# Altium project QUTMS-CC-V00.PrjPcb (part 1 of 2)
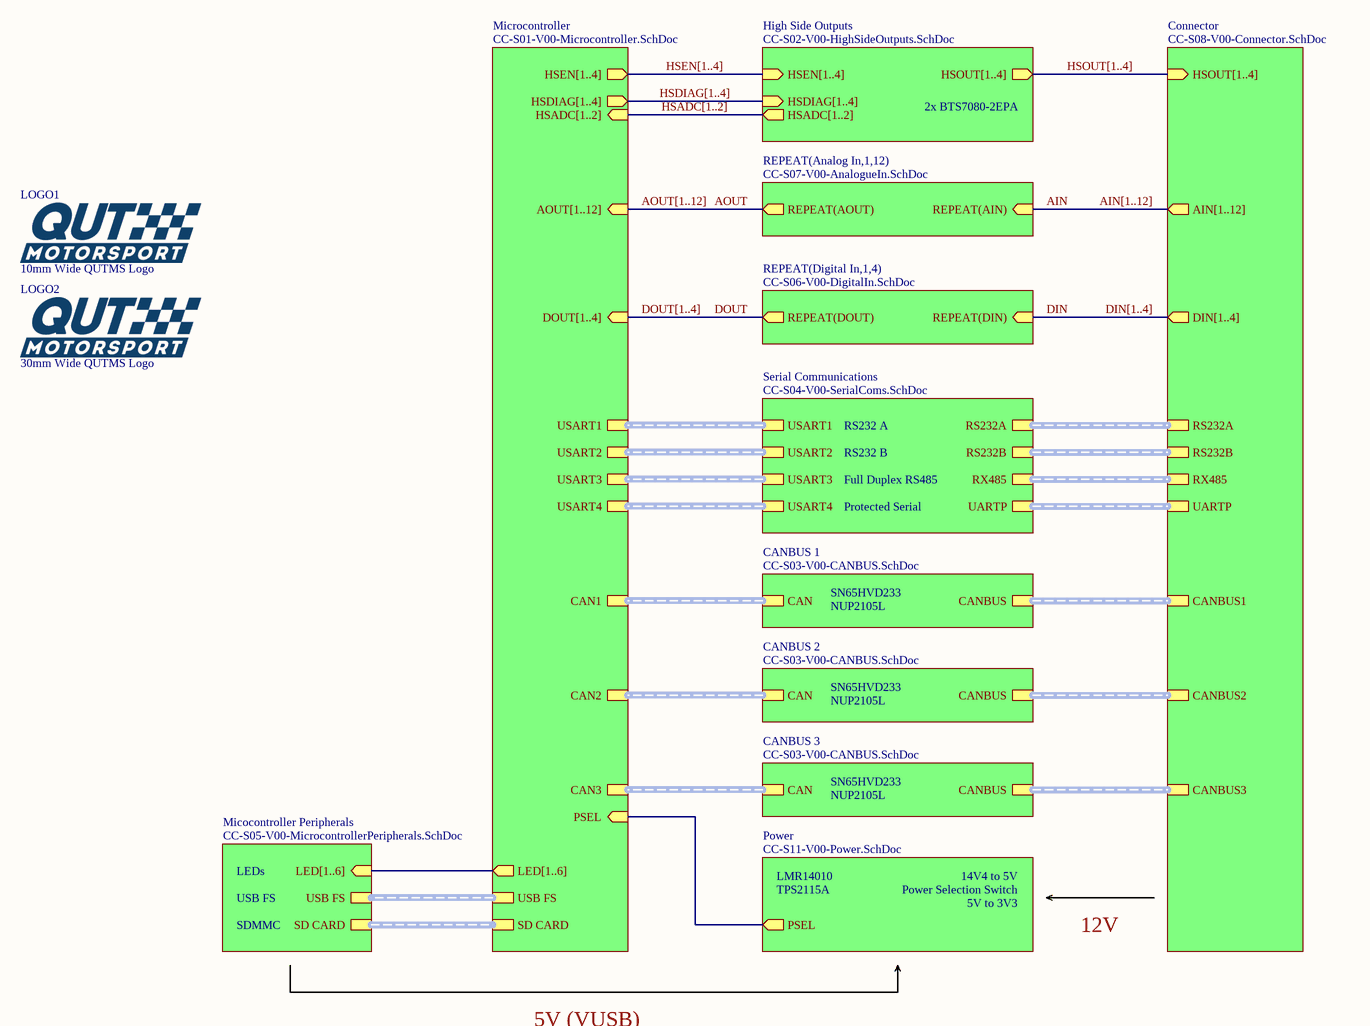
[diagram p0: CC-S00-V00-ChassisController.SchDoc]
13 sheets, 271 parts. Net scope: hierarchical (ports join the sheet entries above them; power ports are global).
Board file: CC-B00-V00.PcbDoc
Sheets:
  CC-S00-V00-ChassisController.SchDoc
    CANBUS 1 = CC-S03-V00-CANBUS.SchDoc
    CANBUS 2 = CC-S03-V00-CANBUS.SchDoc
    CANBUS 3 = CC-S03-V00-CANBUS.SchDoc
    Connector = CC-S08-V00-Connector.SchDoc
    Serial Communications = CC-S04-V00-SerialComs.SchDoc
    Digital In1 = CC-S06-V00-DigitalIn.SchDoc
    Digital In2 = CC-S06-V00-DigitalIn.SchDoc
    Digital In3 = CC-S06-V00-DigitalIn.SchDoc
    Digital In4 = CC-S06-V00-DigitalIn.SchDoc
    Analog In1 = CC-S07-V00-AnalogueIn.SchDoc
    Analog In2 = CC-S07-V00-AnalogueIn.SchDoc
    Analog In3 = CC-S07-V00-AnalogueIn.SchDoc
    Analog In4 = CC-S07-V00-AnalogueIn.SchDoc
    Analog In5 = CC-S07-V00-AnalogueIn.SchDoc
    Analog In6 = CC-S07-V00-AnalogueIn.SchDoc
    Analog In7 = CC-S07-V00-AnalogueIn.SchDoc
    Analog In8 = CC-S07-V00-AnalogueIn.SchDoc
    Analog In9 = CC-S07-V00-AnalogueIn.SchDoc
    Analog In10 = CC-S07-V00-AnalogueIn.SchDoc
    Analog In11 = CC-S07-V00-AnalogueIn.SchDoc
    Analog In12 = CC-S07-V00-AnalogueIn.SchDoc
    High Side Outputs = CC-S02-V00-HighSideOutputs.SchDoc
    Microcontroller = CC-S01-V00-Microcontroller.SchDoc
    Micocontroller Peripherals = CC-S05-V00-MicrocontrollerPeripherals.SchDoc
    Power = CC-S11-V00-Power.SchDoc
      5V Supply = CC-S10-V00-PSU-5V.SchDoc
      3V3 Supply = CC-S09-V00-PSU-3V3.SchDoc
      Power Selection = CC-S12-V00-PowerSwitch.SchDoc

## Sheet CC-S00-V00-ChassisController.SchDoc: Chassis Controller (Interim) 2020
size A3; DrawnBy: Jonn Dillon; DocumentNumber: 1; SheetNumber: 1; SheetTotal: 13; Project: Chassis Controller (Interim) 2020

### Parts
LOGO1  10mm Wide QUTMS Logo  [QUTMS LOGO 10MM]
LOGO2  30mm Wide QUTMS Logo  [QUTMS LOGO 30MM]

### Sub-sheets
CANBUS 1 = CC-S03-V00-CANBUS.SchDoc: CANBUS (harness CANBUS), CAN (harness CAN)
CANBUS 2 = CC-S03-V00-CANBUS.SchDoc: CANBUS (harness CANBUS), CAN (harness CAN)
CANBUS 3 = CC-S03-V00-CANBUS.SchDoc: CAN (harness CAN), CANBUS (harness CANBUS)
Connector = CC-S08-V00-Connector.SchDoc: HSOUT[1..4] (in), CANBUS1 (harness CANBUS), CANBUS2 (harness CANBUS), CANBUS3 (harness CANBUS), AIN[1..12] (out), DIN[1..4] (out), RS232A (harness RS232), RS232B (harness RS232), RX485 (harness RS485), UARTP (harness UART)
High Side Outputs = CC-S02-V00-HighSideOutputs.SchDoc: HSDIAG[1..4] (in), HSOUT[1..4] (out), HSADC[1..2] (out), HSEN[1..4] (in)
Micocontroller Peripherals = CC-S05-V00-MicrocontrollerPeripherals.SchDoc: USB FS (harness USB FS), SD CARD (harness SD CARD), LED[1..6] (in)
Microcontroller = CC-S01-V00-Microcontroller.SchDoc: USB FS (harness USB FS), SD CARD (harness SD CARD), PSEL (in), USART1 (harness UART), USART2 (harness UART), USART3 (harness UART), USART4 (harness UART), HSEN[1..4] (out), HSDIAG[1..4] (out), HSADC[1..2] (in), CAN3 (harness CAN), CAN2 (harness CAN), CAN1 (harness CAN), DOUT[1..4] (in), AOUT[1..12] (in), LED[1..6] (out)
Power = CC-S11-V00-Power.SchDoc: PSEL (out)
REPEAT(Analog In,1,12) = CC-S07-V00-AnalogueIn.SchDoc: REPEAT(AIN) (in), REPEAT(AOUT) (out)
REPEAT(Digital In,1,4) = CC-S06-V00-DigitalIn.SchDoc: REPEAT(DOUT) (out), REPEAT(DIN) (in)
Serial Communications = CC-S04-V00-SerialComs.SchDoc: USART2 (harness UART), USART4 (harness UART), USART1 (harness UART), USART3 (harness UART), RS232B (harness RS232), RS232A (harness RS232), RX485 (harness RS485), UARTP (harness UART)

### Nets
AIN: sheet REPEAT(Analog In,1,12)/REPEAT(AIN)
AOUT: sheet REPEAT(Analog In,1,12)/REPEAT(AOUT)
DIN: sheet REPEAT(Digital In,1,4)/REPEAT(DIN)
DOUT: sheet REPEAT(Digital In,1,4)/REPEAT(DOUT)
PSEL: sheet Microcontroller/PSEL, sheet Power/PSEL

### Buses and harness runs
bus AIN[1..12] = sheet Connector/AIN[1..12]
bus AOUT[1..12] = sheet Microcontroller/AOUT[1..12]
bus DIN[1..4] = sheet Connector/DIN[1..4]
bus DOUT[1..4] = sheet Microcontroller/DOUT[1..4]
bus HSADC[1..2] = sheet High Side Outputs/HSADC[1..2] = sheet Microcontroller/HSADC[1..2]
bus HSDIAG[1..4] = sheet High Side Outputs/HSDIAG[1..4] = sheet Microcontroller/HSDIAG[1..4]
bus HSEN[1..4] = sheet High Side Outputs/HSEN[1..4] = sheet Microcontroller/HSEN[1..4]
bus HSOUT[1..4] = sheet Connector/HSOUT[1..4] = sheet High Side Outputs/HSOUT[1..4]
bus sheet Micocontroller Peripherals/LED[1..6] = sheet Microcontroller/LED[1..6]
harness sheet CANBUS 1/CAN = sheet Microcontroller/CAN1
harness sheet CANBUS 1/CANBUS = sheet Connector/CANBUS1
harness sheet CANBUS 2/CAN = sheet Microcontroller/CAN2
harness sheet CANBUS 2/CANBUS = sheet Connector/CANBUS2
harness sheet CANBUS 3/CAN = sheet Microcontroller/CAN3
harness sheet CANBUS 3/CANBUS = sheet Connector/CANBUS3
harness sheet Connector/RS232A = sheet Serial Communications/RS232A
harness sheet Connector/RS232B = sheet Serial Communications/RS232B
harness sheet Connector/RX485 = sheet Serial Communications/RX485
harness sheet Connector/UARTP = sheet Serial Communications/UARTP
harness sheet Micocontroller Peripherals/SD CARD = sheet Microcontroller/SD CARD
harness sheet Micocontroller Peripherals/USB FS = sheet Microcontroller/USB FS
harness sheet Microcontroller/USART1 = sheet Serial Communications/USART1
harness sheet Microcontroller/USART2 = sheet Serial Communications/USART2
harness sheet Microcontroller/USART3 = sheet Serial Communications/USART3
harness sheet Microcontroller/USART4 = sheet Serial Communications/USART4

### Notes on the sheet
- 2x BTS7080-2EPA
- RS232 A
- RS232 B
- Full Duplex RS485
- Protected Serial
- SN65HVD233
- NUP2105L
- USB FS
- LEDs
- LMR14010
- TPS2115A
- 14V4 to 5V
- Power Selection Switch
- SDMMC
- 5V to 3V3
- 12V
- 5V (VUSB)
- Revision History:
- Sheet Title:
- Rev
- Date
- Description
- Project:
- Size:
- Drawn By:
- A3
- Number:
- Revision:
- Sheet
- Version:
- of
- QUT Motorsport
- O-120, Gardens Point
- 2 George Street
- Brisbane, QLD 4000
- Australia
- Print Date:
- Print Time:
- File Name:

### Library data of the parts
LOGO1 = QUTMS Logo 10mm
LOGO2 = QUTMS Logo 30mm

## Sheet CC-S03-V00-CANBUS.SchDoc: CANBUS (SN65HVD233)
size A3; DrawnBy: Jonn Dillon; DocumentNumber: 4; SheetNumber: 4; SheetTotal: 13; Project: Chassis Controller (Interim) 2020
Used 3 times, as channels CANBUS 1, CANBUS 2, CANBUS 3. Parts and nets are listed once, with the designators drawn on the sheet.
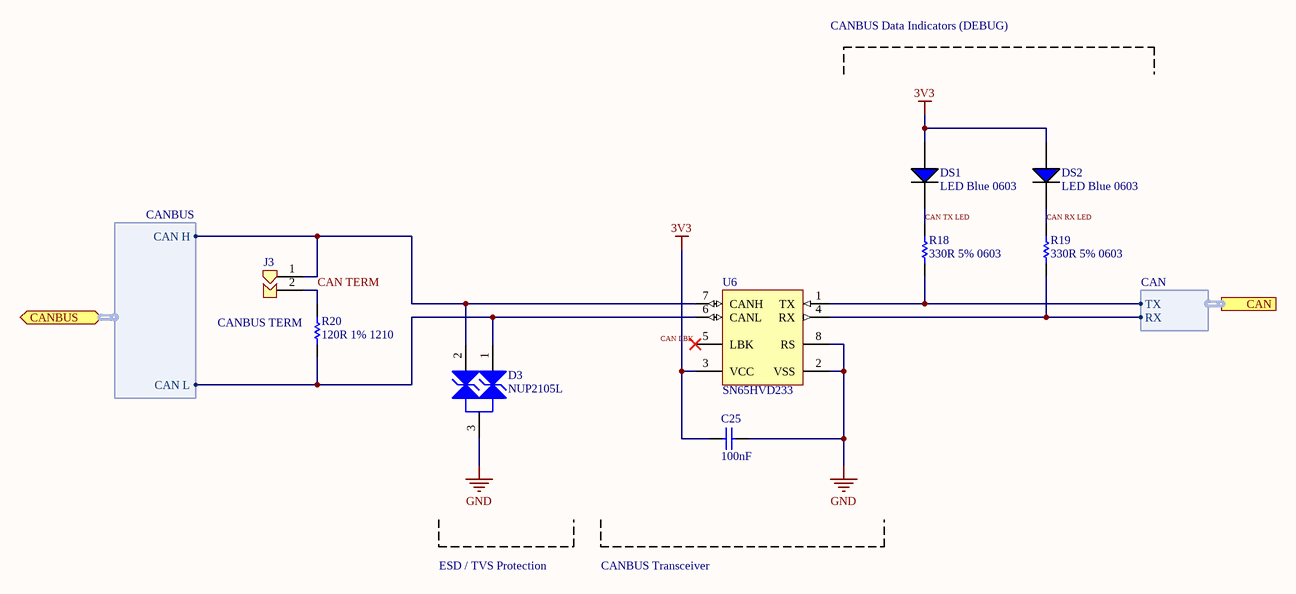
[diagram p1: CC-S03-V00-CANBUS.SchDoc]

### Parts
C25  100nF  [Cap_Ceramic_0603]
D3  NUP2105L  [NUP2105L]
DS1  LED Blue 0603  [LED BLUE 0603]
DS2  LED Blue 0603  [LED BLUE 0603]
J3  Jumper 2Way Solderable  [Jumper_2Way_Solderable]  (value not drawn)
R18  330R 5% 0603  [Res_ThinFilm_0603]
R19  330R 5% 0603  [Res_ThinFilm_0603]
R20  120R 1% 1210  [Res_ThinFilm_1210]
U6  SN65HVD233  [SN65HVD233DR]

### Ports
CAN (harness CAN), CANBUS (bidir, harness CANBUS)

### Harnesses
CANBUS: CAN H, CAN L
CAN: RX, TX

### Nets
3V3: C25.2 DS1.1(A) DS2.1(A) U6.3(VCC)
GND: C25.1 D3.3 U6.2(VSS) U6.8(RS)
CAN LBK: U6.5(LBK)
CAN RX LED: DS2.2(C) R19.2
CAN TERM: J3.2 R20.2
CAN TX LED: DS1.2(C) R18.2
NetD3_1: D3.1 R20.1 U6.6(CANL) ; port CANBUS.CAN L
NetD3_2: D3.2 J3.1 U6.7(CANH) ; port CANBUS.CAN H
NetR18_1: R18.1 U6.1(TX) ; port CAN.TX
NetR19_1: R19.1 U6.4(RX) ; port CAN.RX

### Channels
CANBUS 1: designators end in A
CANBUS 2: designators end in B
CANBUS 3: designators end in C

### Notes on the sheet
- CANBUS Data Indicators (DEBUG)
- (near R20) CANBUS TERM
- ESD / TVS Protection
- CANBUS Transceiver
- Revision History:
- Sheet Title:
- Rev
- Date
- Description
- Project:
- Size:
- Drawn By:
- A3
- Number:
- Revision:
- Sheet
- Version:
- of
- QUT Motorsport
- O-120, Gardens Point
- 2 George Street
- Brisbane, QLD 4000
- Australia
- Print Date:
- Print Time:
- File Name:

### Library data of the parts
C25 = 100nF 50V 5% X7R 0603: Capacitor, Ceramic, SMD, 100nF, 50V, 5%, X7R, 0603
J3 = Jumper 2Way Side Solderable
R18 R19 = 330R 5% 0603: Resistor, SMD, 330R, 0.1W, 5%, 0603
R20 = 120R 1% 1210: Resistor, SMD, 120R, 0.25W, 1%, 1210
D3 = NUP2105L: ComponentLink1Description: Datasheet; ComponentLink1URL: https://www.onsemi.cn/PowerSolutions/document/NUP2105L-D.PDF; Parameter 1: *; ComponentLink2Description: LCSC; ComponentLink2URL: https://lcsc.com/product-detail/TVS_ON-Semiconductor-NUP2105LT1G_C14486.html; ComponentLink3Description: Digikey; ComponentLink3URL: https://www.digikey.com.au/product-detail/en/on-semiconductor/SZNUP2105LT1G/SZNUP2105LT1GOSCT-ND/3487669
U6 = SN65HVD233: ComponentLink1Description: LCSC; ComponentLink1URL: https://lcsc.com/product-detail/CAN-ICs_Texas-Instruments_SN65HVD233DRG4_Texas-Instruments-Texas-Instruments-SN65HVD233DRG4_C61643.html; ComponentLink2Description: Digikey; ComponentLink2URL: https://www.digikey.com.au/product-detail/en/texas-instruments/SN65HVD233DR/296-35967-1-ND/4134960; ComponentLink3Description: Datasheet; ComponentLink3URL: https://www.ti.com/lit/ds/symlink/sn65hvd233.pdf?ts=1588560888178; ComponentLink4Description: Ti Product Page; ComponentLink4URL: https://www.ti.com/product/SN65HVD233

## Sheet CC-S08-V00-Connector.SchDoc: Connector (Superseal 1.0, 60 Pin, Right Angle)
size A3; DrawnBy: Jonn Dillon; DocumentNumber: 9; SheetNumber: 9; SheetTotal: 13; Project: Chassis Controller (Interim) 2020
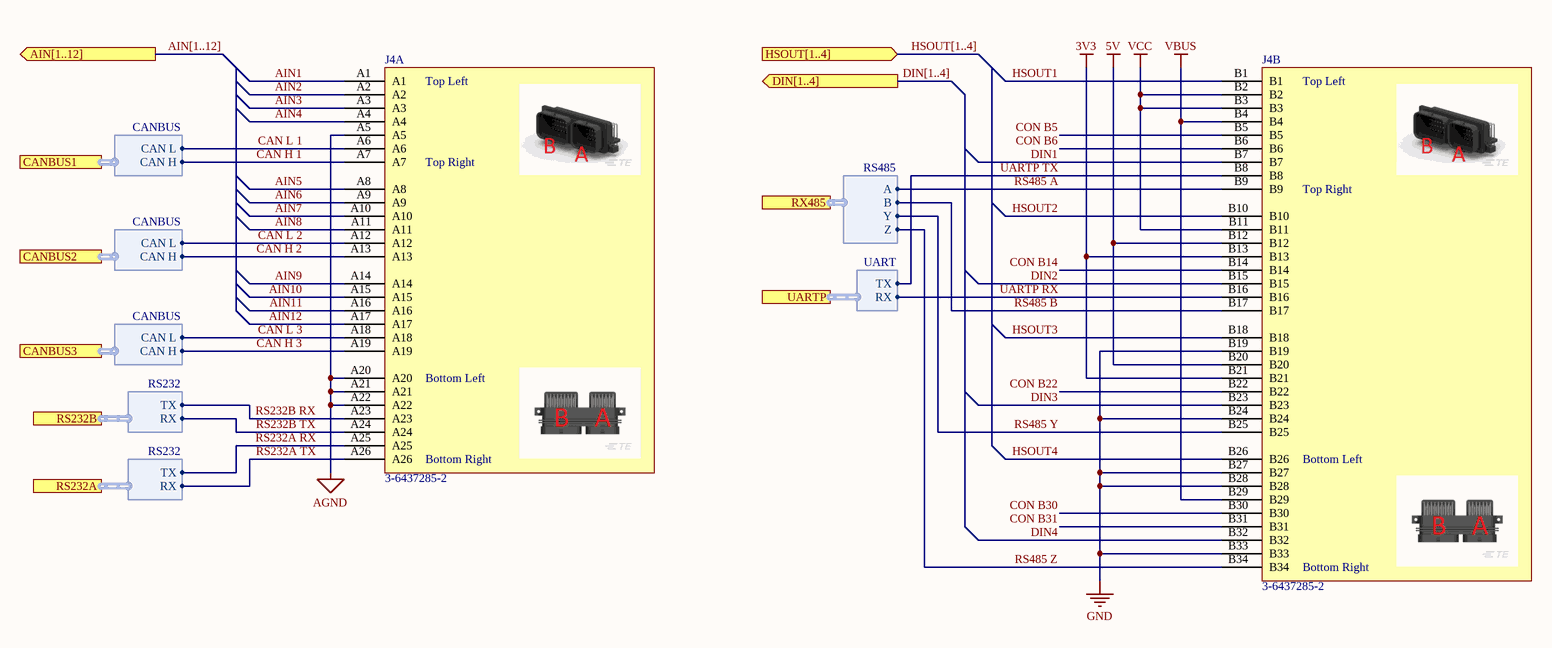
[diagram p2: CC-S08-V00-Connector.SchDoc]

### Parts
J4  3-6437285-2  [SUPERSEAL RIGHT 60WAY]  (parts A,B of 2)

### Ports
AIN[1..12] (out), CANBUS1 (harness CANBUS), CANBUS2 (harness CANBUS), CANBUS3 (harness CANBUS), DIN[1..4] (out), HSOUT[1..4] (in), RS232A (harness RS232), RS232B (harness RS232), RX485 (harness RS485), UARTP (harness UART)

### Harnesses
CANBUS: CAN H, CAN L
RS232: TX, RX
RS485: A, B, Y, Z
UART: TX, RX

### Nets
3V3: J4.B13 J4.B21
5V: J4.B12 J4.B20
AGND: J4.A5 J4.A20 J4.A21 J4.A22
GND: J4.B19 J4.B24 J4.B27 J4.B28 J4.B33
VBUS: J4.B4 J4.B29
VCC: J4.B2 J4.B3 J4.B11
AIN1: J4.A1
AIN2: J4.A2
AIN3: J4.A3
AIN4: J4.A4
AIN5: J4.A8
AIN6: J4.A9
AIN7: J4.A10
AIN8: J4.A11
AIN9: J4.A14
AIN10: J4.A15
AIN11: J4.A16
AIN12: J4.A17
CAN H 1: J4.A7 ; port CANBUS1.CAN H
CAN H 2: J4.A13 ; port CANBUS2.CAN H
CAN H 3: J4.A19 ; port CANBUS3.CAN H
CAN L 1: J4.A6 ; port CANBUS1.CAN L
CAN L 2: J4.A12 ; port CANBUS2.CAN L
CAN L 3: J4.A18 ; port CANBUS3.CAN L
CON B5: J4.B5
CON B6: J4.B6
CON B14: J4.B14
CON B22: J4.B22
CON B30: J4.B30
CON B31: J4.B31
DIN1: J4.B7
DIN2: J4.B15
DIN3: J4.B23
DIN4: J4.B32
HSOUT1: J4.B1
HSOUT2: J4.B10
HSOUT3: J4.B18
HSOUT4: J4.B26
RS232A RX: J4.A25 ; port RS232A.TX
RS232A TX: J4.A26 ; port RS232A.RX
RS232B RX: J4.A23 ; port RS232B.TX
RS232B TX: J4.A24 ; port RS232B.RX
RS485 A: J4.B9 ; port RX485.A
RS485 B: J4.B17 ; port RX485.B
RS485 Y: J4.B25 ; port RX485.Y
RS485 Z: J4.B34 ; port RX485.Z
UARTP RX: J4.B16 ; port UARTP.RX
UARTP TX: J4.B8 ; port UARTP.TX

### Buses and harness runs
bus AIN[1..12] = port AIN[1..12]
bus DIN[1..4] = port DIN[1..4]
bus HSOUT[1..4] = port HSOUT[1..4]

### Notes on the sheet
- Revision History:
- Sheet Title:
- Rev
- Date
- Description
- Project:
- Size:
- Drawn By:
- A3
- Number:
- Revision:
- Sheet
- Version:
- of
- QUT Motorsport
- O-120, Gardens Point
- 2 George Street
- Brisbane, QLD 4000
- Australia
- Print Date:
- Print Time:
- File Name:
- (in symbol 3-6437285-2, part A) Top Left; Top Right; Bottom Left; Bottom Right
- (in symbol 3-6437285-2, part B) Top Left; Top Right; Bottom Left; Bottom Right

### Library data of the parts
J4 = 3-6437285-2: Connector Header Through Hole, Right Angle 60 position 0.118" (3.00mm); ComponentLink1Description: Digikey; ComponentLink1URL: https://www.digikey.com.au/products/en?keywords=3-6437285-2; ComponentLink2Description: TE; ComponentLink2URL: https://www.te.com/global-en/product-3-6437285-2.html

## Sheet CC-S04-V00-SerialComs.SchDoc: Serial Communications (RS232 x2, RS485, Serial)
size A3; DrawnBy: Jonn Dillon; DocumentNumber: 5; SheetNumber: 5; SheetTotal: 13; Project: Chassis Controller (Interim) 2020
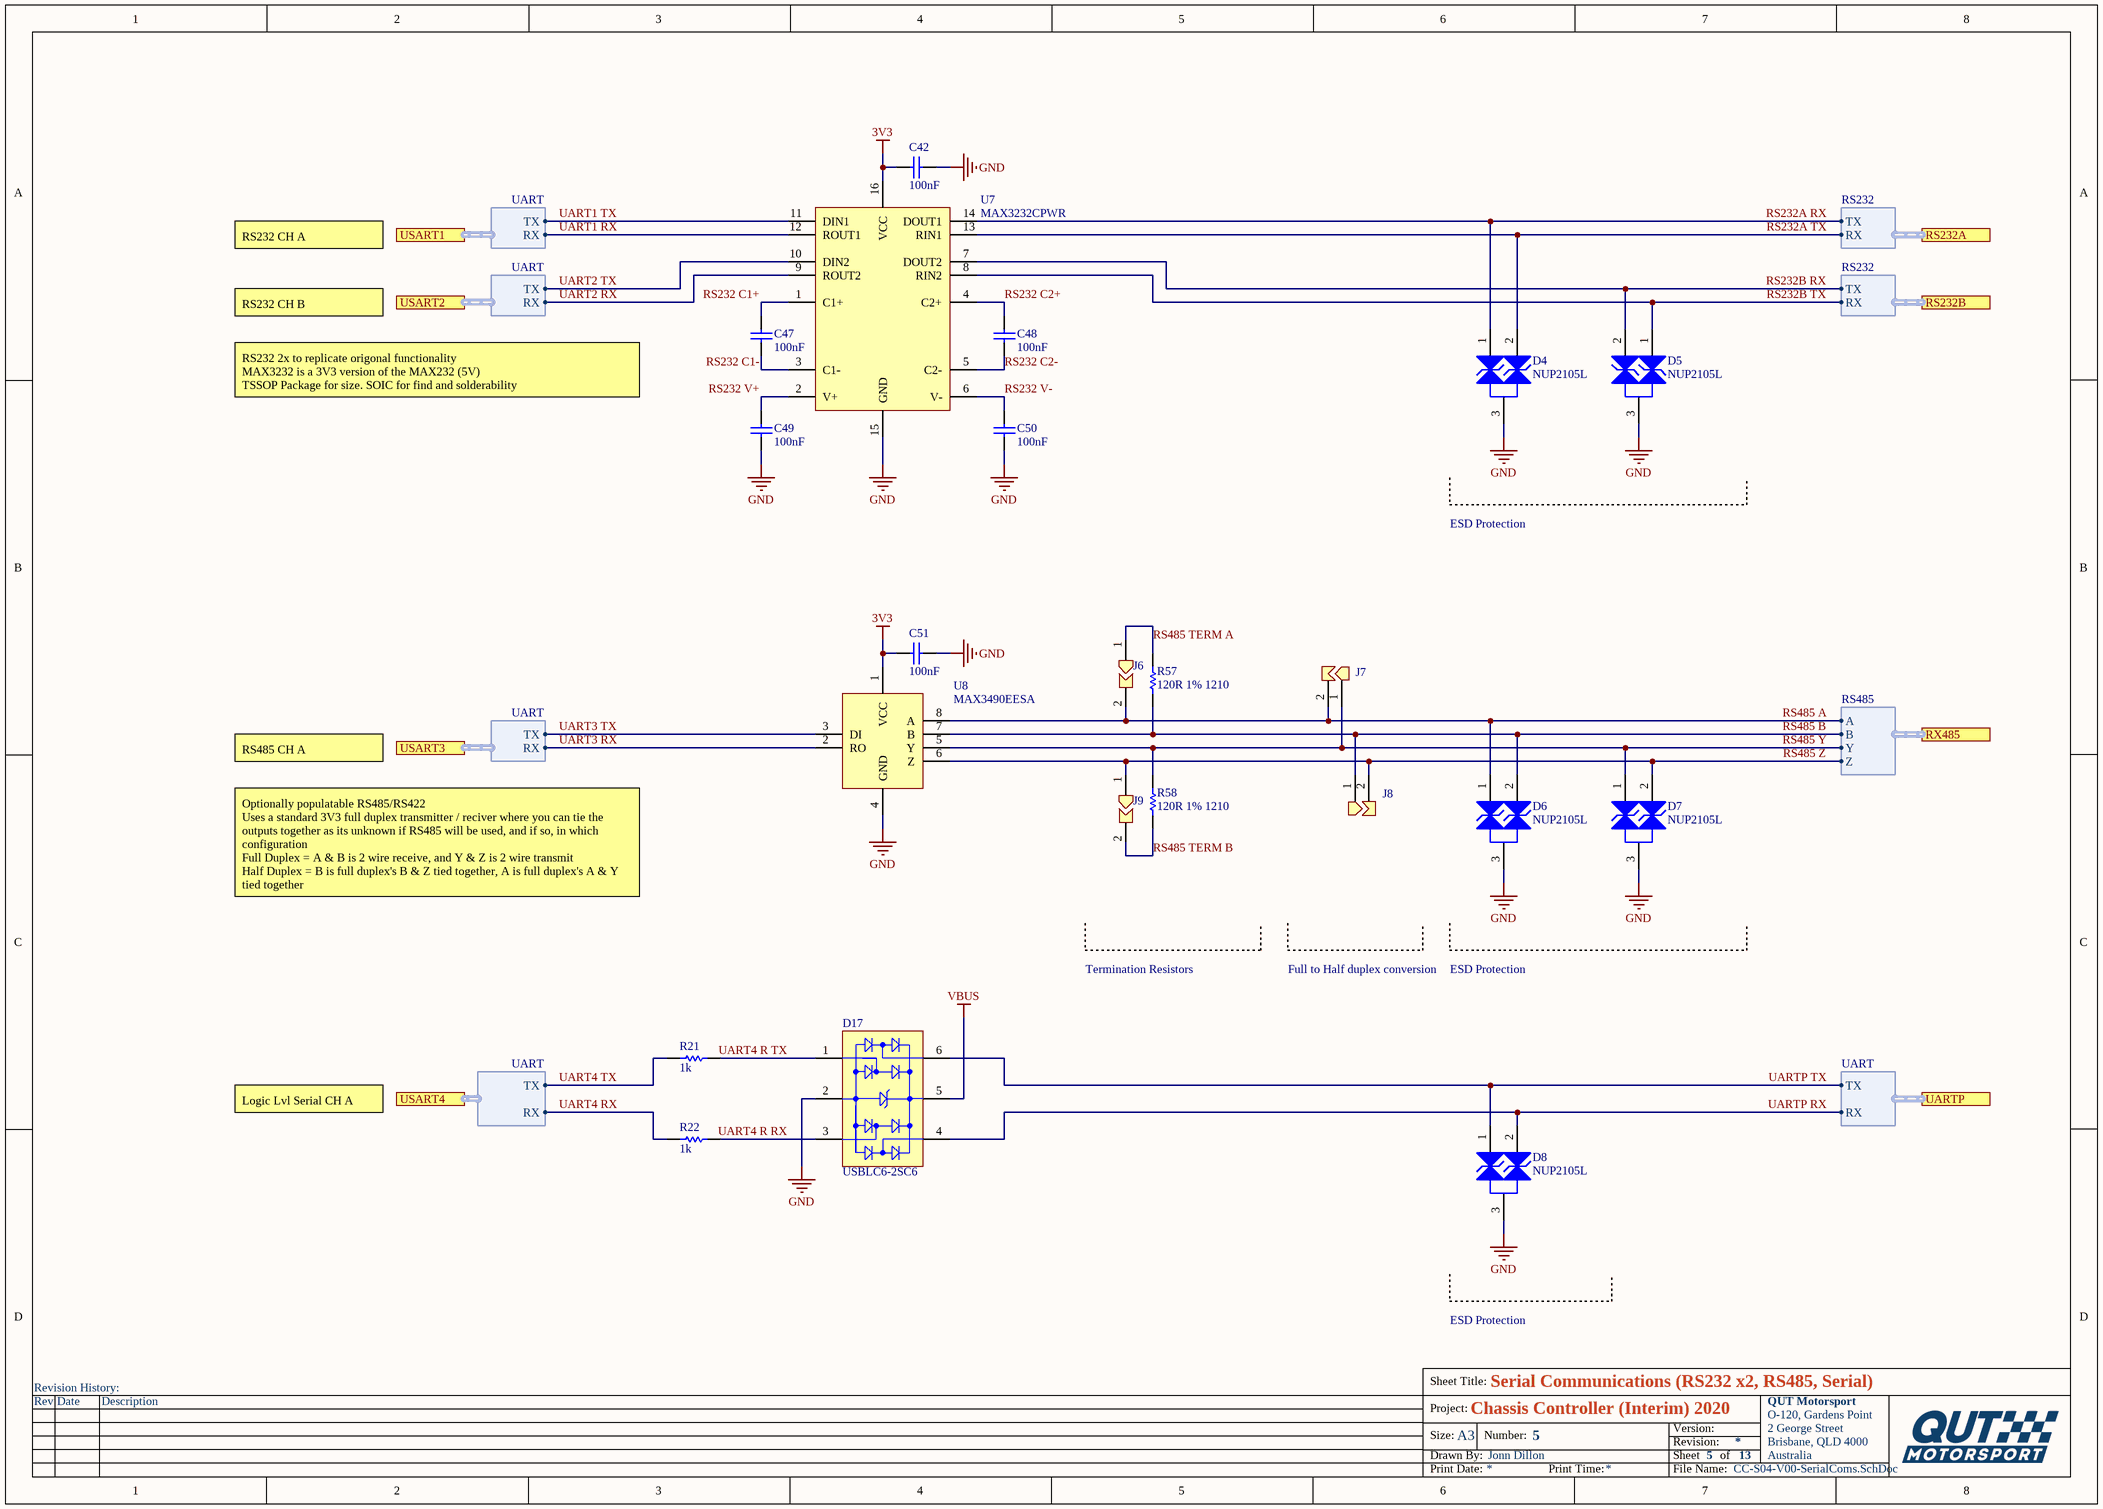
[diagram p3: CC-S04-V00-SerialComs.SchDoc]

### Parts
C42  100nF  [Cap_Ceramic_0603]
C47  100nF  [Cap_Ceramic_0603]
C48  100nF  [Cap_Ceramic_0603]
C49  100nF  [Cap_Ceramic_0603]
C50  100nF  [Cap_Ceramic_0603]
C51  100nF  [Cap_Ceramic_0603]
D4  NUP2105L  [NUP2105L]
D5  NUP2105L  [NUP2105L]
D6  NUP2105L  [NUP2105L]
D7  NUP2105L  [NUP2105L]
D8  NUP2105L  [NUP2105L]
D17  USBLC6-2SC6  [USBLC6-2SC6]
J6  Jumper 2Way Solderable  [Jumper_2Way_Solderable]  (value not drawn)
J7  Jumper 2Way Solderable  [Jumper_2Way_Solderable]  (value not drawn)
J8  Jumper 2Way Solderable  [Jumper_2Way_Solderable]  (value not drawn)
J9  Jumper 2Way Solderable  [Jumper_2Way_Solderable]  (value not drawn)
R21  1k  [Res_ThinFilm_0603]
R22  1k  [Res_ThinFilm_0603]
R57  120R 1% 1210  [Res_ThinFilm_1210]
R58  120R 1% 1210  [Res_ThinFilm_1210]
U7  MAX3232CPWR  [MAX3232CPWR]
U8  MAX3490EESA  [MAX3490EESA]

### Ports
RS232A (harness RS232), RS232B (harness RS232), RX485 (harness RS485), UARTP (harness UART), USART1 (harness UART), USART2 (harness UART), USART3 (harness UART), USART4 (harness UART)

### Harnesses
UART: TX, RX
RS232: TX, RX
RS485: A, B, Y, Z

### Nets
3V3: C42.1 C51.1 U7.16(VCC) U8.1(VCC)
GND: C42.2 C49.1 C50.1 C51.2 D4.3 D5.3 D6.3 D7.3 D8.3 D17.2(GND) U7.15(GND) U8.4(GND)
VBUS: D17.5(VBUS)
RS232 C1+: C47.2 U7.1(C1+)
RS232 C1-: C47.1 U7.3(C1-)
RS232 C2+: C48.2 U7.4(C2+)
RS232 C2-: C48.1 U7.5(C2-)
RS232 V+: C49.2 U7.2(V+)
RS232 V-: C50.2 U7.6(V-)
RS232A RX: D4.1 U7.14(DOUT1) ; port RS232A.TX
RS232A TX: D4.2 U7.13(RIN1) ; port RS232A.RX
RS232B RX: D5.2 U7.7(DOUT2) ; port RS232B.TX
RS232B TX: D5.1 U7.8(RIN2) ; port RS232B.RX
RS485 A: D6.1 J6.2 J7.2 U8.8(A) ; port RX485.A
RS485 B: D6.2 J8.1 R57.1 U8.7(B) ; port RX485.B
RS485 TERM A: J6.1 R57.2
RS485 TERM B: J9.2 R58.1
RS485 Y: D7.1 J7.1 R58.2 U8.5(Y) ; port RX485.Y
RS485 Z: D7.2 J8.2 J9.1 U8.6(Z) ; port RX485.Z
UART1 RX: U7.12(ROUT1) ; port USART1.RX
UART1 TX: U7.11(DIN1) ; port USART1.TX
UART2 RX: U7.9(ROUT2) ; port USART2.RX
UART2 TX: U7.10(DIN2) ; port USART2.TX
UART3 RX: U8.2(RO) ; port USART3.RX
UART3 TX: U8.3(DI) ; port USART3.TX
UART4 R RX: D17.3(I/O_2) R22.2
UART4 R TX: D17.1(I/O_1) R21.2
UART4 RX: R22.1 ; port USART4.RX
UART4 TX: R21.1 ; port USART4.TX
UARTP RX: D8.2 D17.4(I/O_3) ; port UARTP.RX
UARTP TX: D8.1 D17.6(I/O_4) ; port UARTP.TX

### Notes on the sheet
- RS232 CH A
- RS232 CH B
- RS232 2x to replicate origonal functionality
  MAX3232 is a 3V3 version of the MAX232 (5V)
  TSSOP Package for size. SOIC for find and solderability
- ESD Protection
- RS485 CH A
- Optionally populatable RS485/RS422
  Uses a standard 3V3 full duplex transmitter / reciver where you can tie the outputs together as its unknown if RS485 will be used, and if so, in which configuration
  Full Duplex = A & B is 2 wire receive, and Y & Z is 2 wire transmit
  Half Duplex = B is full duplex's B & Z tied together, A is full duplex's A & Y tied together
- Termination Resistors
- Full to Half duplex conversion
- Logic Lvl Serial CH A
- Revision History:
- Sheet Title:
- Rev
- Date
- Description
- Project:
- Size:
- Drawn By:
- A3
- Number:
- Revision:
- Sheet
- Version:
- of
- QUT Motorsport
- O-120, Gardens Point
- 2 George Street
- Brisbane, QLD 4000
- Australia
- Print Date:
- Print Time:
- File Name:

### Library data of the parts
C42 C47-C51 = 100nF 50V 5% X7R 0603: as C25 on sheet CC-S03-V00-CANBUS
D17 = USBLC6-2SC6: Very low capacitance ESD protection, 3.5 pF, -40 to 125 degC, 6-Pin SOT23, RoHS, Tape and Reel
J6 J9 = Jumper 2Way Vert Solderable
J7 J8 = Jumper 2Way Side Solderable
R21 R22 = 1k 5% 0603: Resistor, SMD, 1k, 0.1W, 5%, 0603
R57 R58 = 120R 1% 1210: Resistor, SMD, 120R, 0.25W, 1%, 1210
U7 = MAX3232CPWR: MAX3232CPWR - IC, LINE DRIVER, 3-5.5V, SMD
U8 = MAX3490EESA: IC, RS422/RS485 TRANSCEIVER, 3.6V, SOIC8
D4-D8 = NUP2105L: ComponentLink1Description: Datasheet; ComponentLink1URL: https://www.onsemi.cn/PowerSolutions/document/NUP2105L-D.PDF; ComponentLink2Description: LCSC; ComponentLink2URL: https://lcsc.com/product-detail/TVS_ON-Semiconductor-NUP2105LT1G_C14486.html; ComponentLink3Description: Digikey; ComponentLink3URL: https://www.digikey.com.au/product-detail/en/on-semiconductor/SZNUP2105LT1G/SZNUP2105LT1GOSCT-ND/3487669

## Sheet CC-S06-V00-DigitalIn.SchDoc: Input Protection (Digital)
size A3; DrawnBy: Jonn Dillon; DocumentNumber: 7; SheetNumber: 7; SheetTotal: 13; Project: Chassis Controller (Interim) 2020
Used 4 times, as channels Digital In1, Digital In2, Digital In3, Digital In4. Parts and nets are listed once, with the designators drawn on the sheet.
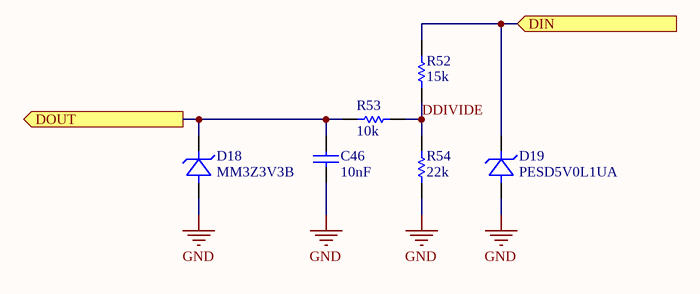
[diagram p4: CC-S06-V00-DigitalIn.SchDoc]

### Parts
C46  10nF  [Cap_Ceramic_0603]
D18  MM3Z3V3B  [SOD323F]
D19  PESD5V0L1UA  [SOD323F]
R52  15k  [Res_ThinFilm_0603]
R53  10k  [Res_ThinFilm_0603]
R54  22k  [Res_ThinFilm_0603]

### Ports
DIN (in), DOUT (out)

### Nets
GND: C46.1 D18.A(Anode) D19.A(Anode) R54.1
DDIVIDE: R52.1 R53.2 R54.2
DIN: D19.K(Cathode) R52.2 ; port DIN
DOUT: C46.2 D18.K(Cathode) R53.1 ; port DOUT

### Channels
Digital In1: designators end in A; ports DIN=DIN1 DOUT=DOUT1
Digital In2: designators end in B; ports DIN=DIN2 DOUT=DOUT2
Digital In3: designators end in C; ports DIN=DIN3 DOUT=DOUT3
Digital In4: designators end in D; ports DIN=DIN4 DOUT=DOUT4

### Notes on the sheet
- Revision History:
- Sheet Title:
- Rev
- Date
- Description
- Project:
- Size:
- Drawn By:
- A3
- Number:
- Revision:
- Sheet
- Version:
- of
- QUT Motorsport
- O-120, Gardens Point
- 2 George Street
- Brisbane, QLD 4000
- Australia
- Print Date:
- Print Time:
- File Name:

### Library data of the parts
C46 = 10nF 50V 5% X7R 0603: Capacitor, Ceramic, SMD, 10nF, 50V, 5%, X7R, 0603
D18 = MM3Z3V3B: Diode, SMD, Zenner, 3.3V, 2%, 410mW, SOD-323F; ComponentLink1Description: Digikey; ComponentLink1URL: https://www.digikey.com.au/product-detail/en/on-semiconductor/MM3Z3V3B/MM3Z3V3BCT-ND/1626881
D19 = PESD5V0L1UA: 12V Clamp 3.5A (8/20µs) Ipp Tvs Diode Surface Mount SOD-323
R52 = 15k 5% 0603: Resistor, SMD, 15k, 0.1W, 5%, 0603
R53 = 10k 5% 0603: Resistor, SMD, 10k, 0.1W, 5%, 0603
R54 = 22k 5% 0603: Resistor, SMD, 22k, 0.1W, 5%, 0603

## Sheet CC-S07-V00-AnalogueIn.SchDoc: Input Protection (Anagloue)
size A3; DrawnBy: Jonn Dillon; DocumentNumber: 8; SheetNumber: 8; SheetTotal: 13; Project: Chassis Controller (Interim) 2020
Used 12 times, as channels Analog In1, Analog In2, Analog In3, Analog In4, Analog In5, Analog In6, Analog In7, Analog In8, Analog In9, Analog In10, Analog In11, Analog In12. Parts and nets are listed once, with the designators drawn on the sheet.
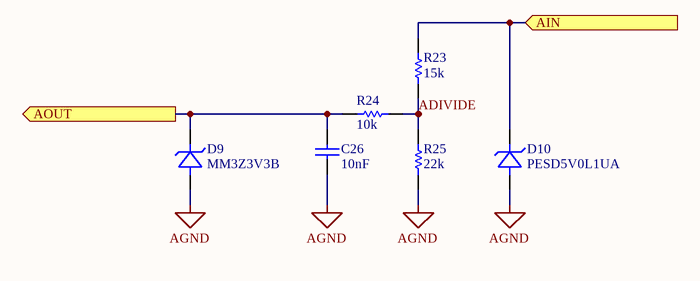
[diagram p5: CC-S07-V00-AnalogueIn.SchDoc]

### Parts
C26  10nF  [Cap_Ceramic_0603]
D9  MM3Z3V3B  [SOD323F]
D10  PESD5V0L1UA  [SOD323F]
R23  15k  [Res_ThinFilm_0603]
R24  10k  [Res_ThinFilm_0603]
R25  22k  [Res_ThinFilm_0603]

### Ports
AIN (in), AOUT (out)

### Nets
AGND: C26.1 D9.A(Anode) D10.A(Anode) R25.1
ADIVIDE: R23.1 R24.2 R25.2
AIN: D10.K(Cathode) R23.2 ; port AIN
AOUT: C26.2 D9.K(Cathode) R24.1 ; port AOUT

### Channels
Analog In1: designators end in A; ports AIN=AIN1 AOUT=AOUT1
Analog In2: designators end in B; ports AIN=AIN2 AOUT=AOUT2
Analog In3: designators end in C; ports AIN=AIN3 AOUT=AOUT3
Analog In4: designators end in D; ports AIN=AIN4 AOUT=AOUT4
Analog In5: designators end in E; ports AIN=AIN5 AOUT=AOUT5
Analog In6: designators end in F; ports AIN=AIN6 AOUT=AOUT6
Analog In7: designators end in G; ports AIN=AIN7 AOUT=AOUT7
Analog In8: designators end in H; ports AIN=AIN8 AOUT=AOUT8
Analog In9: designators end in I; ports AIN=AIN9 AOUT=AOUT9
Analog In10: designators end in J; ports AIN=AIN10 AOUT=AOUT10
Analog In11: designators end in K; ports AIN=AIN11 AOUT=AOUT11
Analog In12: designators end in L; ports AIN=AIN12 AOUT=AOUT12

### Notes on the sheet
- Revision History:
- Sheet Title:
- Rev
- Date
- Description
- Project:
- Size:
- Drawn By:
- A3
- Number:
- Revision:
- Sheet
- Version:
- of
- QUT Motorsport
- O-120, Gardens Point
- 2 George Street
- Brisbane, QLD 4000
- Australia
- Print Date:
- Print Time:
- File Name:

### Library data of the parts
C26 = 10nF 50V 5% X7R 0603: as C46 on sheet CC-S06-V00-DigitalIn
D9 = MM3Z3V3B: as D18 on sheet CC-S06-V00-DigitalIn; ComponentLink1Description: Digikey; ComponentLink1URL: https://www.digikey.com.au/product-detail/en/on-semiconductor/MM3Z3V3B/MM3Z3V3BCT-ND/1626881
D10 = PESD5V0L1UA: as D19 on sheet CC-S06-V00-DigitalIn
R23 = 15k 5% 0603: Resistor, SMD, 15k, 0.1W, 5%, 0603
R24 = 10k 5% 0603: Resistor, SMD, 10k, 0.1W, 5%, 0603
R25 = 22k 5% 0603: Resistor, SMD, 22k, 0.1W, 5%, 0603

## Sheet CC-S02-V00-HighSideOutputs.SchDoc: High Side Outputs (BTS7080-2EPA)
size A3; DrawnBy: Jonn Dillon; DocumentNumber: 3; SheetNumber: 3; SheetTotal: 13; Project: Chassis Controller (Interim) 2020
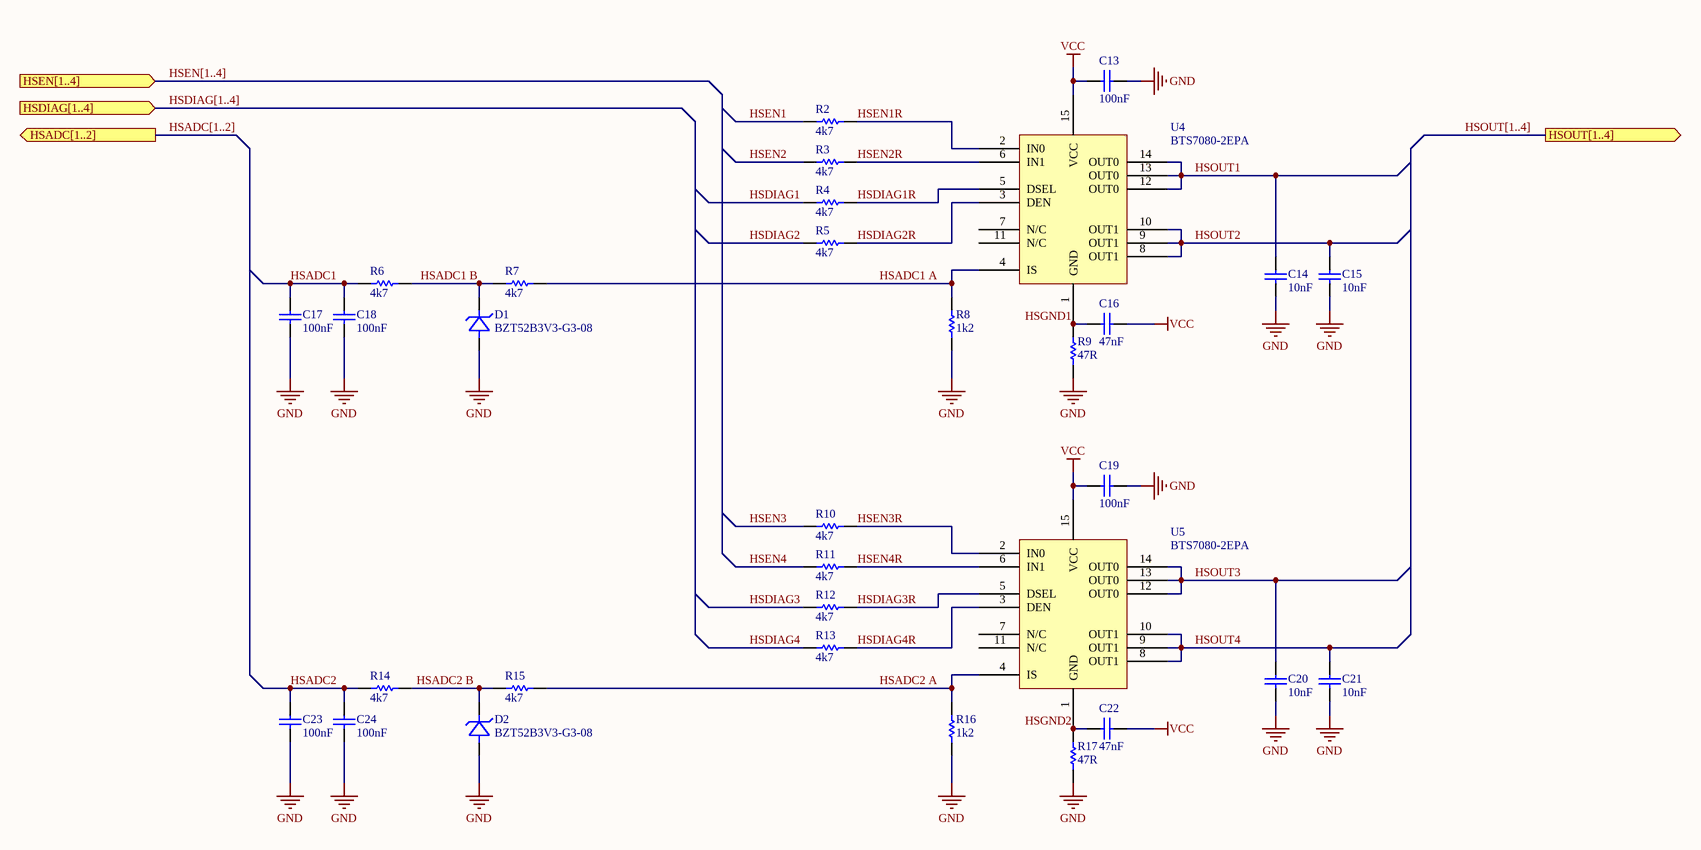
[diagram p6: CC-S02-V00-HighSideOutputs.SchDoc]

### Parts
C13  100nF  [Cap_Ceramic_0603]
C14  10nF  [Cap_Ceramic_0603]
C15  10nF  [Cap_Ceramic_0603]
C16  47nF  [Cap_Ceramic_0603]
C17  100nF  [Cap_Ceramic_0603]
C18  100nF  [Cap_Ceramic_0603]
C19  100nF  [Cap_Ceramic_0603]
C20  10nF  [Cap_Ceramic_0603]
C21  10nF  [Cap_Ceramic_0603]
C22  47nF  [Cap_Ceramic_0603]
C23  100nF  [Cap_Ceramic_0603]
C24  100nF  [Cap_Ceramic_0603]
D1  BZT52B3V3-G3-08  [SOD123]
D2  BZT52B3V3-G3-08  [SOD123]
R2  4k7  [Res_ThinFilm_0603]
R3  4k7  [Res_ThinFilm_0603]
R4  4k7  [Res_ThinFilm_0603]
R5  4k7  [Res_ThinFilm_0603]
R6  4k7  [Res_ThinFilm_0603]
R7  4k7  [Res_ThinFilm_0603]
R8  1k2  [Res_ThinFilm_0603]
R9  47R  [Res_ThinFilm_0603]
R10  4k7  [Res_ThinFilm_0603]
R11  4k7  [Res_ThinFilm_0603]
R12  4k7  [Res_ThinFilm_0603]
R13  4k7  [Res_ThinFilm_0603]
R14  4k7  [Res_ThinFilm_0603]
R15  4k7  [Res_ThinFilm_0603]
R16  1k2  [Res_ThinFilm_0603]
R17  47R  [Res_ThinFilm_0603]
U4  BTS7080-2EPA  [BTS70802EPA]
U5  BTS7080-2EPA  [BTS70802EPA]

### Ports
HSADC[1..2] (out), HSDIAG[1..4] (in), HSEN[1..4] (in), HSOUT[1..4] (out)

### Nets
GND: C13.2 C14.1 C15.1 C17.1 C18.1 C19.2 C20.1 C21.1 C23.1 C24.1 D1.A(Anode) D2.A(Anode) R8.2 R9.1 R16.2 R17.1
VCC: C13.1 C16.2 C19.1 C22.2 U4.15(VCC) U5.15(VCC)
HSADC1: C17.2 C18.2 R6.1
HSADC1 A: R7.2 R8.1 U4.4(IS)
HSADC1 B: D1.K(Cathode) R6.2 R7.1
HSADC2: C23.2 C24.2 R14.1
HSADC2 A: R15.2 R16.1 U5.4(IS)
HSADC2 B: D2.K(Cathode) R14.2 R15.1
HSDIAG1: R4.1
HSDIAG1R: R4.2 U4.5(DSEL)
HSDIAG2: R5.1
HSDIAG2R: R5.2 U4.3(DEN)
HSDIAG3: R12.1
HSDIAG3R: R12.2 U5.5(DSEL)
HSDIAG4: R13.1
HSDIAG4R: R13.2 U5.3(DEN)
HSEN1: R2.1
HSEN1R: R2.2 U4.2(IN0)
HSEN2: R3.1
HSEN2R: R3.2 U4.6(IN1)
HSEN3: R10.1
HSEN3R: R10.2 U5.2(IN0)
HSEN4: R11.1
HSEN4R: R11.2 U5.6(IN1)
HSGND1: C16.1 R9.2 U4.1(GND)
HSGND2: C22.1 R17.2 U5.1(GND)
HSOUT1: C14.2 U4.12(OUT0) U4.13(OUT0) U4.14(OUT0)
HSOUT2: C15.2 U4.8(OUT1) U4.9(OUT1) U4.10(OUT1)
HSOUT3: C20.2 U5.12(OUT0) U5.13(OUT0) U5.14(OUT0)
HSOUT4: C21.2 U5.8(OUT1) U5.9(OUT1) U5.10(OUT1)

Not connected (* = marked no-connect by the designer): U4 7(N/C) 11(N/C); U5 7(N/C) 11(N/C)

### Buses and harness runs
bus HSADC[1..2] = port HSADC[1..2]
bus HSDIAG[1..4] = port HSDIAG[1..4]
bus HSEN[1..4] = port HSEN[1..4]
bus HSOUT[1..4] = port HSOUT[1..4]

### Notes on the sheet
- Revision History:
- Sheet Title:
- Rev
- Date
- Description
- Project:
- Size:
- Drawn By:
- A3
- Number:
- Revision:
- Sheet
- Version:
- of
- QUT Motorsport
- O-120, Gardens Point
- 2 George Street
- Brisbane, QLD 4000
- Australia
- Print Date:
- Print Time:
- File Name:

### Library data of the parts
C13 C17-C19 C23 C24 = 100nF 50V 5% X7R 0603: as C25 on sheet CC-S03-V00-CANBUS
C14 C15 C20 C21 = 10nF 50V 5% X7R 0603: as C46 on sheet CC-S06-V00-DigitalIn
C16 C22 = 47nF 50V 5% X7R 0603: Capacitor, Ceramic, SMD, 47nF, 50V, 5%, X7R, 0603
D1 D2 = BZT52B3V3-G3-08: Diode, SMD, Zenner, 3.3V, 2%, 410mW, SOD-123; ComponentLink1Description: Digikey; ComponentLink1URL: https://www.digikey.com.au/product-detail/en/vishay-semiconductor-diodes-division/BZT52B3V3-G3-08/BZT52B3V3-G3-08GICT-ND/8284035; ComponentLink2Description: Datasheet; ComponentLink2URL: https://www.vishay.com/docs/83340/bzt52g.pdf
R2-R7 R10-R15 = 4k7 5% 0603: Resistor, SMD, 4k7, 0.1W, 5%, 0603
R8 R16 = 1k2 5% 0603: Resistor, SMD, 1k2, 0.1W, 5%, 0603
R9 R17 = 47R 5% 0603: Resistor, SMD, 47R, 0.1W, 5%, 0603
U4 U5 = BTS7080-2EPA: Power Switch/Driver 1:1 N-Channel 3A PG-TSDSO-14-22; ComponentLink1Description: Digikey; ComponentLink1URL: https://www.digikey.com/product-detail/en/infineon-technologies/BTS70802EPAXUMA1/BTS70802EPAXUMA1CT-ND/8346497; ComponentLink2Description: Datasheet; ComponentLink2URL: https://www.infineon.com/dgdl/Infineon-BTS7080-2EPA-DataSheet-v01_06-EN.pdf?fileId=5546d4625e763904015e941bf21e2dbe

## Sheet CC-S01-V00-Microcontroller.SchDoc: Microcontroller (STM32F765VI)
size A3; DrawnBy: Jonn Dillon; DocumentNumber: 2; SheetNumber: 2; SheetTotal: 13; Project: Chassis Controller (Interim) 2020
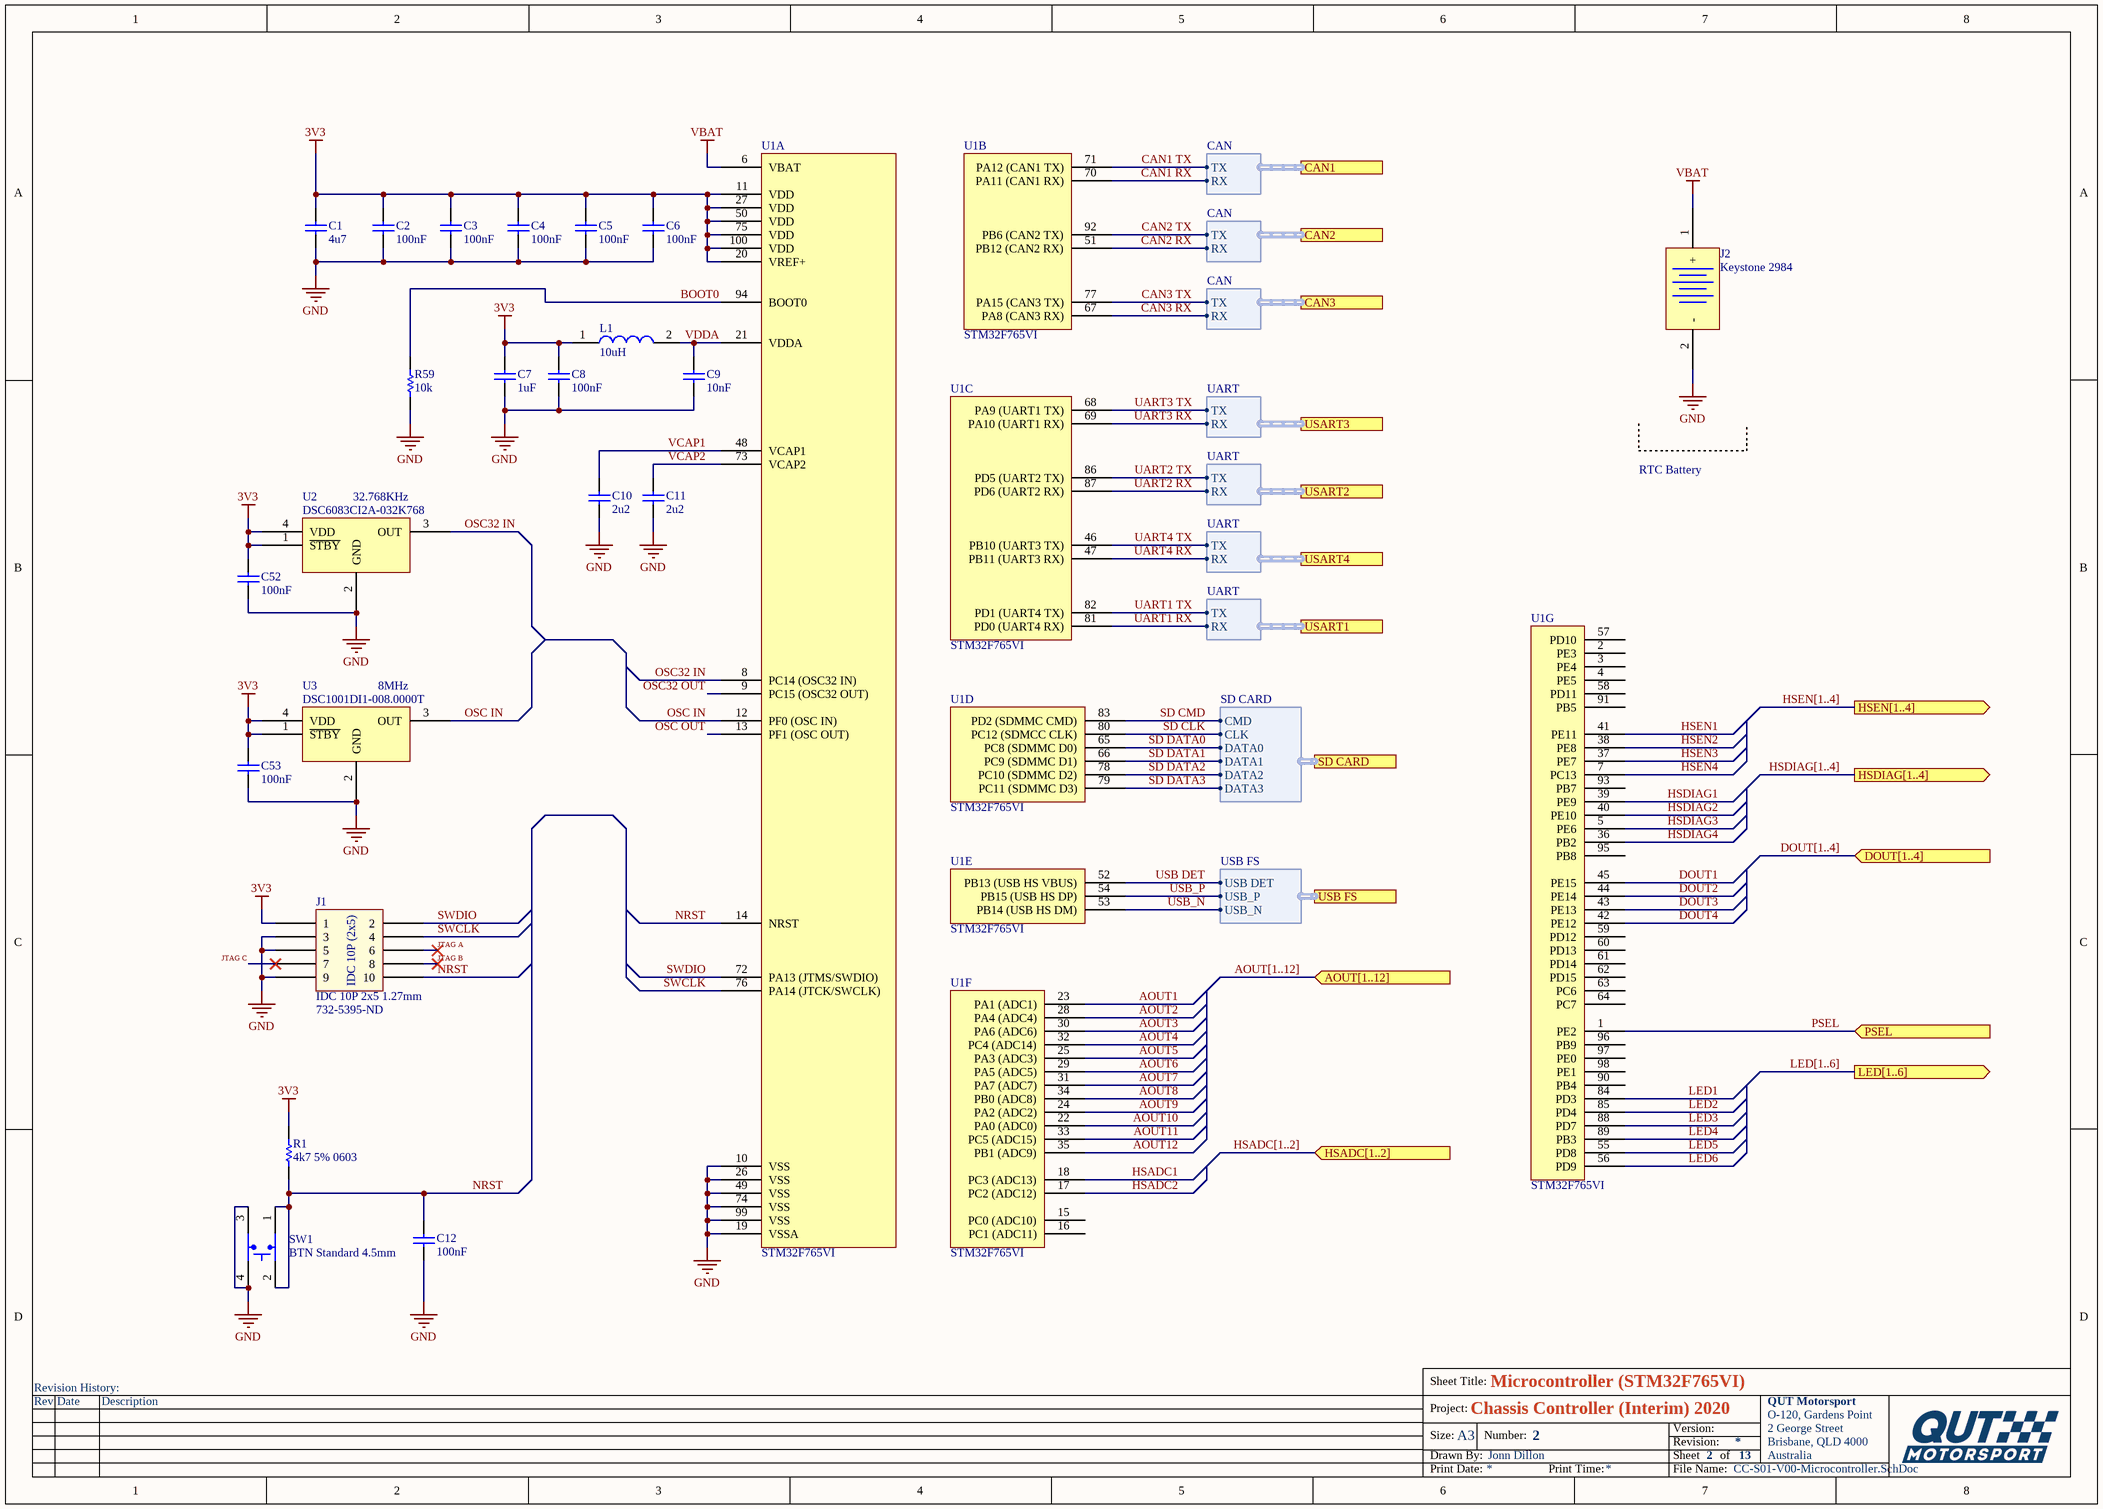
[diagram p7: CC-S01-V00-Microcontroller.SchDoc]

### Parts
C1  4u7  [Cap_Ceramic_0603]
C2  100nF  [Cap_Ceramic_0603]
C3  100nF  [Cap_Ceramic_0603]
C4  100nF  [Cap_Ceramic_0603]
C5  100nF  [Cap_Ceramic_0603]
C6  100nF  [Cap_Ceramic_0603]
C7  1uF  [Cap_Ceramic_0603]
C8  100nF  [Cap_Ceramic_0603]
C9  10nF  [Cap_Ceramic_0603]
C10  2u2  [Cap_Ceramic_0603]
C11  2u2  [Cap_Ceramic_0603]
C12  100nF  [Cap_Ceramic_0603]
C52  100nF  [Cap_Ceramic_0603]
C53  100nF  [Cap_Ceramic_0603]
J1  IDC 10P 2x5 1.27mm  [IDC 1.27MM 10P]
J2  Keystone 2984  [KEYSTONE 2894]
L1  10uH  [Inductor_0603]
R1  4k7 5% 0603  [Res_ThinFilm_0603]
R59  10k  [Res_ThinFilm_0603]
SW1  BTN Standard 4.5mm  [BTN STANDARD 4.5mm X 4.5mm]
U1  STM32F765VI  [LQFP-100]  (parts A,B,C,D,E,F,G of 7)
U2  DSC6083CI2A-032K768  [DSC6083CI2A-032K768]
U3  DSC1001DI1-008.0000T  [DSC1001DI1-008.0000TCT-ND]

### Ports
AOUT[1..12] (in), CAN1 (harness CAN), CAN2 (harness CAN), CAN3 (harness CAN), DOUT[1..4] (in), HSADC[1..2] (in), HSDIAG[1..4] (out), HSEN[1..4] (out), LED[1..6] (out), PSEL (in), SD CARD (harness SD CARD), USART1 (harness UART), USART2 (harness UART), USART3 (harness UART), USART4 (harness UART), USB FS (harness USB FS)

### Harnesses
USB FS: USB DET, USB_N, USB_P
SD CARD: DATA2, DATA3, CMD, CLK, DATA0, DATA1
UART: TX, RX
CAN: RX, TX

### Nets
3V3: C1.2 C2.2 C3.2 C4.2 C5.2 C6.2 C7.2 C8.2 C52.2 C53.2 J1.1 L1.1 R1.2 U1.11(VDD) U1.20(VREF+) U1.27(VDD) U1.50(VDD) U1.75(VDD) U1.100(VDD) U2.1(~{STBY}) U2.4(VDD) U3.1(~{STBY}) U3.4(VDD)
GND: C1.1 C2.1 C3.1 C4.1 C5.1 C6.1 C7.1 C8.1 C9.1 C10.1 C11.1 C12.1 C52.1 C53.1 J1.3 J1.5 J1.9 J2.2(-) R59.1 SW1.3 SW1.4 U1.10(VSS) U1.19(VSSA) U1.26(VSS) U1.49(VSS) U1.74(VSS) U1.99(VSS) U2.2(GND) U3.2(GND)
VBAT: J2.1(+) U1.6(VBAT)
AOUT1: U1.23(PA1_(ADC1))
AOUT2: U1.28(PA4_(ADC4))
AOUT3: U1.30(PA6_(ADC6))
AOUT4: U1.32(PC4_(ADC14))
AOUT5: U1.25(PA3_(ADC3))
AOUT6: U1.29(PA5_(ADC5))
AOUT7: U1.31(PA7_(ADC7))
AOUT8: U1.34(PB0_(ADC8))
AOUT9: U1.24(PA2_(ADC2))
AOUT10: U1.22(PA0_(ADC0))
AOUT11: U1.33(PC5_(ADC15))
AOUT12: U1.35(PB1_(ADC9))
BOOT0: R59.2 U1.94(BOOT0)
CAN1 RX: U1.70(PA11_(CAN1_RX)) ; port CAN1.RX
CAN1 TX: U1.71(PA12_(CAN1_TX)) ; port CAN1.TX
CAN2 RX: U1.51(PB12_(CAN2_RX)) ; port CAN2.RX
CAN2 TX: U1.92(PB6_(CAN2_TX)) ; port CAN2.TX
CAN3 RX: U1.67(PA8_(CAN3_RX)) ; port CAN3.RX
CAN3 TX: U1.77(PA15_(CAN3_TX)) ; port CAN3.TX
DOUT1: U1.45(PE15)
DOUT2: U1.44(PE14)
DOUT3: U1.43(PE13)
DOUT4: U1.42(PE12)
HSADC1: U1.18(PC3_(ADC13))
HSADC2: U1.17(PC2_(ADC12))
HSDIAG1: U1.39(PE9)
HSDIAG2: U1.40(PE10)
HSDIAG3: U1.5(PE6)
HSDIAG4: U1.36(PB2)
HSEN1: U1.41(PE11)
HSEN2: U1.38(PE8)
HSEN3: U1.37(PE7)
HSEN4: U1.7(PC13)
JTAG A: J1.6
JTAG B: J1.8
JTAG C: J1.7
LED1: U1.84(PD3)
LED2: U1.85(PD4)
LED3: U1.88(PD7)
LED4: U1.89(PB3)
LED5: U1.55(PD8)
LED6: U1.56(PD9)
NRST: C12.2 J1.10 R1.1 SW1.1 SW1.2 U1.14(NRST)
OSC32 IN: U1.8(PC14_(OSC32_IN)) U2.3(OUT)
OSC32 OUT: U1.9(PC15_(OSC32_OUT))
OSC IN: U1.12(PF0_(OSC_IN)) U3.3(OUT)
OSC OUT: U1.13(PF1_(OSC_OUT))
PSEL: U1.1(PE2) ; port PSEL
SD CLK: U1.80(PC12_(SDMCC_CLK)) ; port SD CARD.CLK
SD CMD: U1.83(PD2_(SDMMC_CMD)) ; port SD CARD.CMD
SD DATA0: U1.65(PC8_(SDMMC_D0)) ; port SD CARD.DATA0
SD DATA1: U1.66(PC9_(SDMMC_D1)) ; port SD CARD.DATA1
SD DATA2: U1.78(PC10_(SDMMC_D2)) ; port SD CARD.DATA2
SD DATA3: U1.79(PC11_(SDMMC_D3)) ; port SD CARD.DATA3
SWCLK: J1.4 U1.76(PA14_(JTCK/SWCLK))
SWDIO: J1.2 U1.72(PA13_(JTMS/SWDIO))
UART1 RX: U1.81(PD0_(UART4_RX)) ; port USART1.RX
UART1 TX: U1.82(PD1_(UART4_TX)) ; port USART1.TX
UART2 RX: U1.87(PD6_(UART2_RX)) ; port USART2.RX
UART2 TX: U1.86(PD5_(UART2_TX)) ; port USART2.TX
UART3 RX: U1.69(PA10_(UART1_RX)) ; port USART3.RX
UART3 TX: U1.68(PA9_(UART1_TX)) ; port USART3.TX
UART4 RX: U1.47(PB11_(UART3_RX)) ; port USART4.RX
UART4 TX: U1.46(PB10_(UART3_TX)) ; port USART4.TX
USB DET: U1.52(PB13_(USB_HS_VBUS)) ; port USB FS.USB DET
USB_N: U1.53(PB14_(USB_HS_DM)) ; port USB FS.USB_N
USB_P: U1.54(PB15_(USB_HS_DP)) ; port USB FS.USB_P
VCAP1: C10.2 U1.48(VCAP1)
VCAP2: C11.2 U1.73(VCAP2)
VDDA: C9.2 L1.2 U1.21(VDDA)

Not connected (* = marked no-connect by the designer): U1 2(PE3) 3(PE4) 4(PE5) 15(PC0_(ADC10)) 16(PC1_(ADC11)) 57(PD10) 58(PD11) 59(PD12) 60(PD13) 61(PD14) 62(PD15) 63(PC6) 64(PC7) 90(PB4) 91(PB5) 93(PB7) 95(PB8) 96(PB9) 97(PE0) 98(PE1)

### Buses and harness runs
bus AOUT[1..12] = port AOUT[1..12]
bus DOUT[1..4] = port DOUT[1..4]
bus HSADC[1..2] = port HSADC[1..2]
bus HSDIAG[1..4] = port HSDIAG[1..4]
bus HSEN[1..4] = port HSEN[1..4]
bus LED[1..6] = port LED[1..6]

### Notes on the sheet
- (near U2) 32.768KHz
- RTC Battery
- (near U3) 8MHz
- (near J1) 732-5395-ND
- Revision History:
- Sheet Title:
- Rev
- Date
- Description
- Project:
- Size:
- Drawn By:
- A3
- Number:
- Revision:
- Sheet
- Version:
- of
- QUT Motorsport
- O-120, Gardens Point
- 2 George Street
- Brisbane, QLD 4000
- Australia
- Print Date:
- Print Time:
- File Name:
- (in symbol IDC 10P 2x5 1.27mm) IDC 10P (2x5)

### Library data of the parts
C1 = 4u7 50V 5% X7R 0603: Capacitor, Ceramic, SMD, 4u7, 50V, 5%, X7R, 0603
C2-C6 C8 C12 C52 C53 = 100nF 50V 5% X7R 0603: as C25 on sheet CC-S03-V00-CANBUS
C7 = 1uF 25V 5% X7R 0603: Capacitor, Ceramic, SMD, 1uF, 25V, 5%, X7R, 0603
C9 = 10nF 50V 5% X7R 0603: as C46 on sheet CC-S06-V00-DigitalIn
C10 C11 = 2u2 25V 5% X7R 0603: Capacitor, Ceramic, SMD, 2u2, 25V, 5%, X7R, 0603
J2 = Keystone 2984: Battery Retainer Coin, 12.0mm 1 Cell SMD (SMT) Tab
L1 = 10uH, 10%, 0603: ComponentLink1Description: Digikey; ComponentLink1URL: https://www.digikey.com.au/product-detail/en/w%C3%BCrth-elektronik/74404064221/732-7261-1-ND/5353241; ComponentLink2Description: LCSC A; ComponentLink2URL: https://lcsc.com/product-detail/Power-Inductors_Sunlord-SWPA6045S221MT_C91047.html; ComponentLink3Description: LCSC B; ComponentLink3URL: https://lcsc.com/product-detail/Power-Inductors_SXN-Shun-Xiang-Nuo-Elec-SMNR6045-221MT_C467145.html
R1 = 4k7 5% 0603: Resistor, SMD, 4k7, 0.1W, 5%, 0603
R59 = 10k 5% 0603: Resistor, SMD, 10k, 0.1W, 5%, 0603
SW1 = BTN Standard 4.5mm: Standard 4.5mm X 4.5mm momentary button; ComponentLink1Description: LCSC; ComponentLink1URL: https://lcsc.com/product-detail/Tactile-Switches_BRIGHT-TSA063G50-250_C294565.html
U1 = STM32F765VI: ARM® Cortex®-M7 STM32F7 Microcontroller IC 32-Bit 216MHz 2MB (2M x 8) FLASH 100-LQFP (14x14); ComponentLink1Description: Digikey; ComponentLink1URL: https://www.digikey.com/product-detail/en/stmicroelectronics/STM32F765VIT6/497-16631-ND/6137842; ComponentLink2Description: Datasheet
U2 = DSC6083CI2A-032K768: 32.768kHz XO (Standard) CMOS Oscillator 1.8V ~ 3.3V 4-SMD, No Lead
U3 = DSC1001DI1-008.0000T: 8MHz XO (Standard) CMOS Oscillator 1.8 ~ 3.3V Standby (Power Down) 4-SMD, No Lead

## Sheet CC-S05-V00-MicrocontrollerPeripherals.SchDoc: Microcontroller Peripherals (USB FS, SD Card, LEDs)
size A3; DrawnBy: Jonn Dillon; DocumentNumber: 6; SheetNumber: 6; SheetTotal: 13; Project: Chassis Controller (Interim) 2020
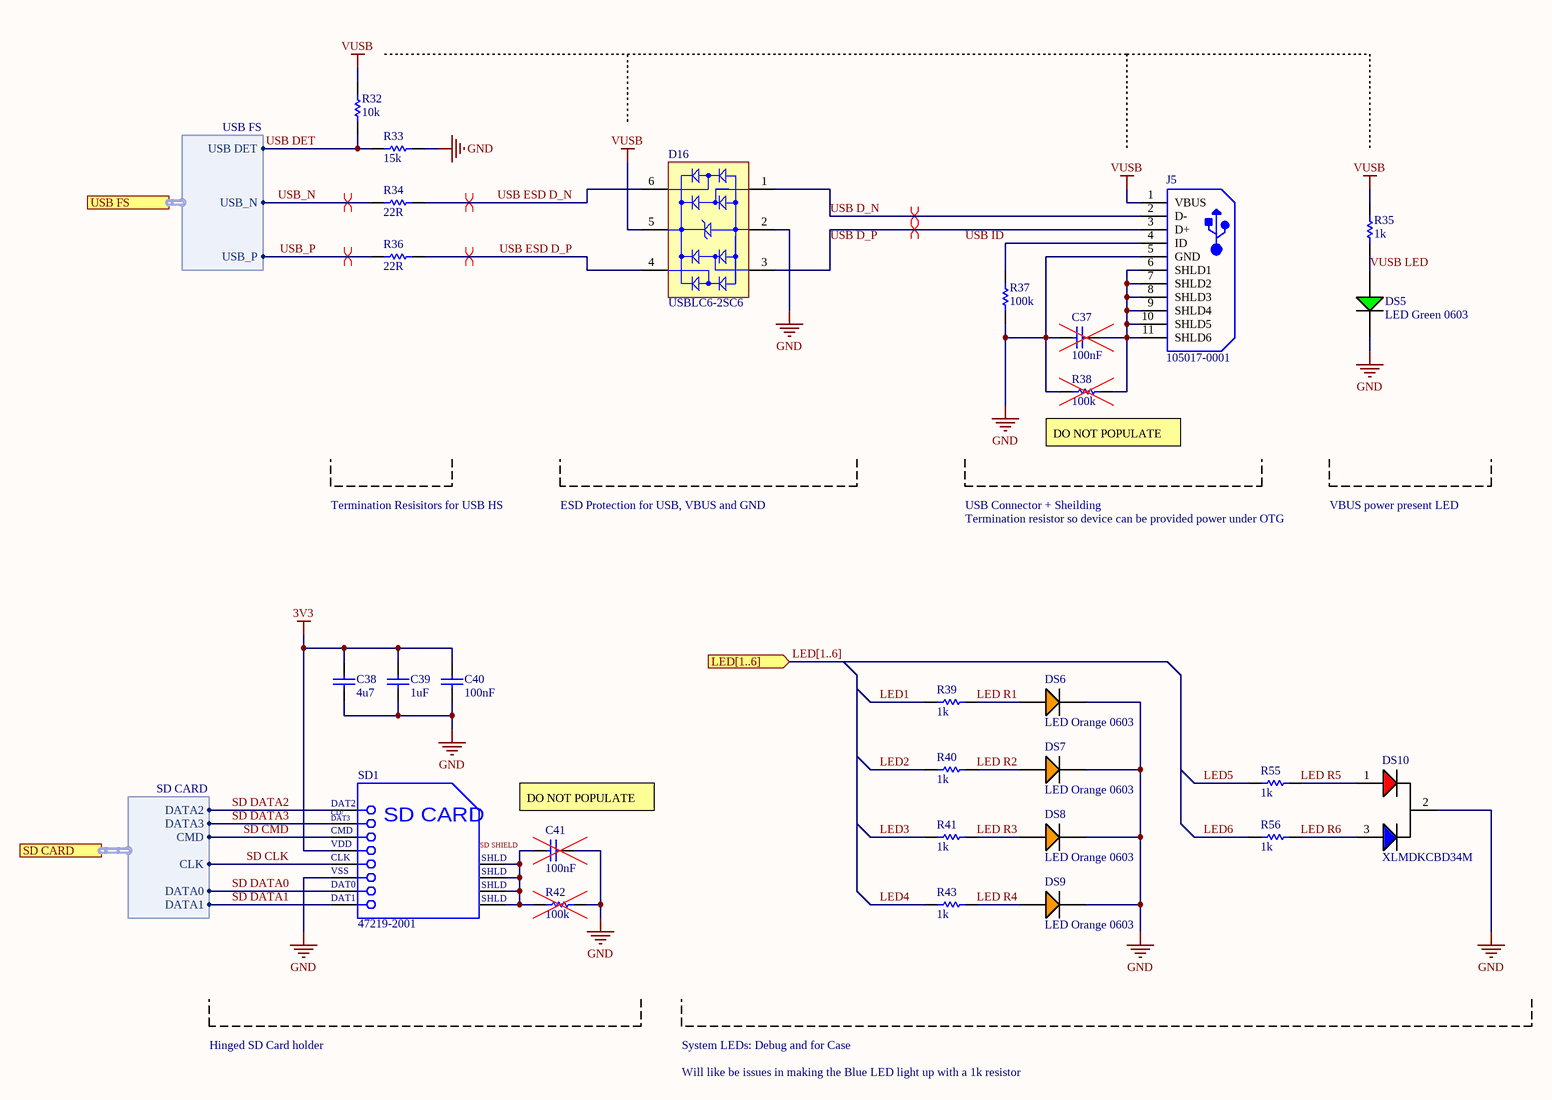
[diagram p8: CC-S05-V00-MicrocontrollerPeripherals.SchDoc]

### Parts
C37  100nF  [Cap_Ceramic_0603]
C38  4u7  [Cap_Ceramic_0603]
C39  1uF  [Cap_Ceramic_0603]
C40  100nF  [Cap_Ceramic_0603]
C41  100nF  [Cap_Ceramic_0603]
D16  USBLC6-2SC6  [USBLC6-2SC6]
DS5  LED Green 0603  [LED GREEN 0603]
DS6  LED Orange 0603  [LED ORANGE 0603]
DS7  LED Orange 0603  [LED ORANGE 0603]
DS8  LED Orange 0603  [LED ORANGE 0603]
DS9  LED Orange 0603  [LED ORANGE 0603]
DS10  XLMDKCBD34M  [XLxxxx34x]
J5  105017-0001  [105017-0001]
R32  10k  [Res_ThinFilm_0603]
R33  15k  [Res_ThinFilm_0603]
R34  22R  [Res_ThinFilm_0603]
R35  1k  [Res_ThinFilm_0603]
R36  22R  [Res_ThinFilm_0603]
R37  100k  [Res_ThinFilm_0603]
R38  100k  [Res_ThinFilm_0603]
R39  1k  [Res_ThinFilm_0603]
R40  1k  [Res_ThinFilm_0603]
R41  1k  [Res_ThinFilm_0603]
R42  100k  [Res_ThinFilm_0603]
R43  1k  [Res_ThinFilm_0603]
R55  1k  [Res_ThinFilm_0603]
R56  1k  [Res_ThinFilm_0603]
SD1  47219-2001  [47219-2001]

### Ports
LED[1..6] (in), SD CARD (harness SD CARD), USB FS (harness USB FS)

### Harnesses
USB FS: USB DET, USB_N, USB_P
SD CARD: DATA2, DATA3, CMD, CLK, DATA0, DATA1

### Nets
3V3: C38.2 C39.2 C40.2 SD1.4(VDD)
GND: C37.1 C38.1 C39.1 C40.1 C41.2 D16.2(GND) DS5.2(C) DS6.2(C) DS7.2(C) DS8.2(C) DS9.2(C) DS10.2(C) J5.5(GND) R33.2 R37.1 R38.2 R42.1 SD1.6(VSS)
VUSB: D16.5(VBUS) J5.1(VBUS) R32.2 R35.2
LED1: R39.2
LED2: R40.2
LED3: R41.2
LED4: R43.2
LED5: R55.2
LED6: R56.2
LED R1: DS6.1(A) R39.1
LED R2: DS7.1(A) R40.1
LED R3: DS8.1(A) R41.1
LED R4: DS9.1(A) R43.1
LED R5: DS10.1(A) R55.1
LED R6: DS10.3(A) R56.1
SD CLK: SD1.5(CLK) ; port SD CARD.CLK
SD CMD: SD1.3(CMD) ; port SD CARD.CMD
SD DATA0: SD1.7(DAT0) ; port SD CARD.DATA0
SD DATA1: SD1.8(DAT1) ; port SD CARD.DATA1
SD DATA2: SD1.1(DAT2) ; port SD CARD.DATA2
SD DATA3: SD1.2(CD/DAT3) ; port SD CARD.DATA3
SD SHIELD: C41.1 R42.2 SD1.9(SHLD) SD1.10(SHLD) SD1.11(SHLD) SD1.12(SHLD)
USB D_N: D16.1(I/O_1) J5.2(D-)
USB D_P: D16.3(I/O_2) J5.3(D+)
USB DET: R32.1 R33.1 ; port USB FS.USB DET
USB ESD D_N: D16.6(I/O_4) R34.2
USB ESD D_P: D16.4(I/O_3) R36.2
USB ID: J5.4(ID) R37.2
USB_N: R34.1 ; port USB FS.USB_N
USB_P: R36.1 ; port USB FS.USB_P
VUSB LED: DS5.1(A) R35.1
NetC37_2: C37.2 J5.6(SHLD1) J5.7(SHLD2) J5.8(SHLD3) J5.9(SHLD4) J5.10(SHLD5) J5.11(SHLD6) R38.1

### Buses and harness runs
bus LED[1..6] = port LED[1..6]

### Layout directives
differential pair: USB D_N, USB D_P, USB ESD D_N, USB ESD D_P, USB_N, USB_P

### Notes on the sheet
- (near R38) DO NOT POPULATE
- Termination Resisitors for USB HS
- ESD Protection for USB, VBUS and GND
- USB Connector + Sheilding
- Termination resistor so device can be provided power under OTG
- VBUS power present LED
- DO NOT POPULATE
- Hinged SD Card holder
- System LEDs: Debug and for Case
- Will like be issues in making the Blue LED light up with a 1k resistor
- Revision History:
- Sheet Title:
- Rev
- Date
- Description
- Project:
- Size:
- Drawn By:
- A3
- Number:
- Revision:
- Sheet
- Version:
- of
- QUT Motorsport
- O-120, Gardens Point
- 2 George Street
- Brisbane, QLD 4000
- Australia
- Print Date:
- Print Time:
- File Name:
- (in symbol 47219-2001) CD/; DAT3; SD CARD

### Library data of the parts
C37 C40 C41 = 100nF 50V 5% X7R 0603: as C25 on sheet CC-S03-V00-CANBUS
C38 = 4u7 50V 5% X7R 0603: as C1 on sheet CC-S01-V00-Microcontroller
C39 = 1uF 25V 5% X7R 0603: as C7 on sheet CC-S01-V00-Microcontroller
D16 = USBLC6-2SC6: as D17 on sheet CC-S04-V00-SerialComs
DS10 = XLMDKCBD34M: Blue, Red 465nm Blue, 630nm Red LED Indication - Discrete 3.3V Blue, 1.95V Red Radial; ComponentLink1Description: Digikey; ComponentLink1URL: https://www.digikey.com.au/product-detail/en/sunled/XLMDKCBD34M/1497-1307-ND/4901632
J5 = 105017-0001: Micro-USB B Receptacle, Right Angle, Bottom Mount, Surface Mount, with Solder Tabs, -30 to 85 degC, 5-Pin USB, RoHS, Tape and Reel
R32 = 10k 5% 0603: Resistor, SMD, 10k, 0.1W, 5%, 0603
R33 = 15k 5% 0603: Resistor, SMD, 15k, 0.1W, 5%, 0603
R34 R36 = 22R 5% 0603: Resistor, SMD, 22R, 0.1W, 5%, 0603
R35 R39-R41 R43 R55 R56 = 1k 5% 0603: Resistor, SMD, 1k, 0.1W, 5%, 0603
R37 R38 R42 = 100k 5%, 0603: Resistor, SMD, 100k, 0.1W, 5%, 0603
SD1 = 47219-2001: MicroSD Card Connector, Hinge Type, -40 to 85 degC, 8-Pin SMD, RoHS, Tape and Reel

## Sheet CC-S11-V00-Power.SchDoc: CC Power System (VCC, USB to 5V, VBUS, 3V3)
size A3; DrawnBy: Jonn Dillon; DocumentNumber: 12; SheetNumber: 12; SheetTotal: 13; Project: Chassis Controller (Interim) 2020
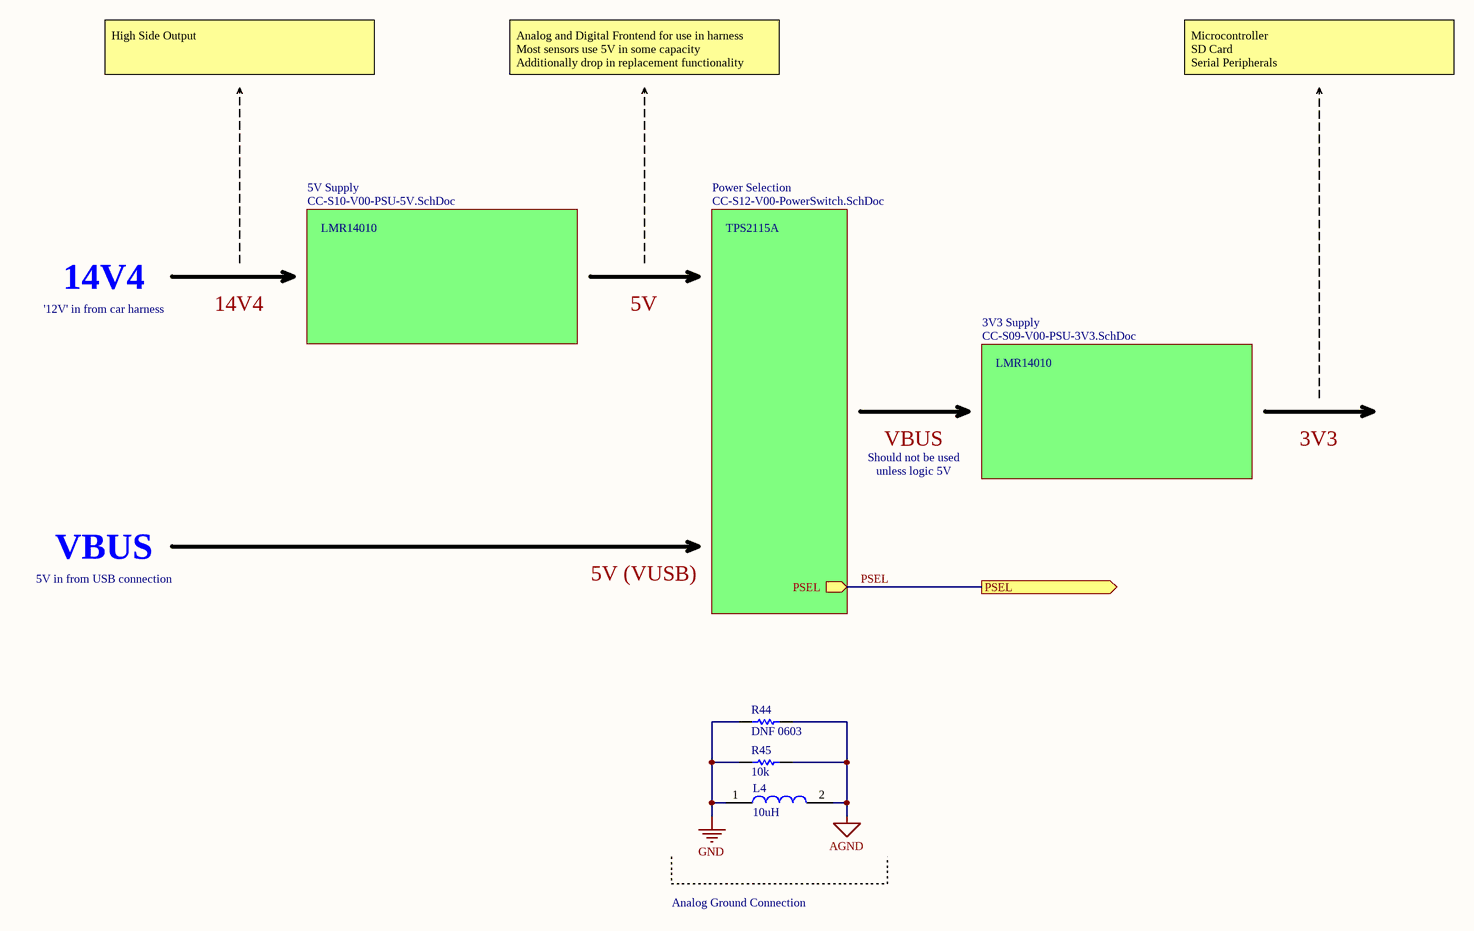
[diagram p9: CC-S11-V00-Power.SchDoc]

### Parts
L4  10uH  [Inductor_0603]
R44  DNF 0603  [Res_ThinFilm_0603]
R45  10k  [Res_ThinFilm_0603]

### Sub-sheets
3V3 Supply = CC-S09-V00-PSU-3V3.SchDoc: no entries
5V Supply = CC-S10-V00-PSU-5V.SchDoc: no entries
Power Selection = CC-S12-V00-PowerSwitch.SchDoc: PSEL (out)

### Ports
PSEL (out)

### Nets
AGND: L4.2 R44.2 R45.2
GND: L4.1 R44.1 R45.1
PSEL: port PSEL, sheet Power Selection/PSEL

### Notes on the sheet
- High Side Output
- Analog and Digital Frontend for use in harness
  Most sensors use 5V in some capacity
  Additionally drop in replacement functionality
- Microcontroller
  SD Card
  Serial Peripherals
- LMR14010
- TPS2115A
- 14V4
- 5V
- '12V' in from car harness
- VBUS
- 3V3
- Should not be used
- unless logic 5V
- 5V (VUSB)
- 5V in from USB connection
- Analog Ground Connection
- Revision History:
- Sheet Title:
- Rev
- Date
- Description
- Project:
- Size:
- Drawn By:
- A3
- Number:
- Revision:
- Sheet
- Version:
- of
- QUT Motorsport
- O-120, Gardens Point
- 2 George Street
- Brisbane, QLD 4000
- Australia
- Print Date:
- Print Time:
- File Name:

### Library data of the parts
L4 = 10uH, 10%, 0603: ComponentLink1Description: Digikey; ComponentLink1URL: https://www.digikey.com.au/product-detail/en/w%C3%BCrth-elektronik/74404064221/732-7261-1-ND/5353241; ComponentLink2Description: LCSC A; ComponentLink2URL: https://lcsc.com/product-detail/Power-Inductors_Sunlord-SWPA6045S221MT_C91047.html; ComponentLink3Description: LCSC B; ComponentLink3URL: https://lcsc.com/product-detail/Power-Inductors_SXN-Shun-Xiang-Nuo-Elec-SMNR6045-221MT_C467145.html
R44 = DNF 0603: Resistor, SMD, DNF, 0.1W, 0603
R45 = 10k 5% 0603: Resistor, SMD, 10k, 0.1W, 5%, 0603

## Sheet CC-S10-V00-PSU-5V.SchDoc: Power Supply (9-25V to 5V @ 0.1-0.3A)
size A3; DrawnBy: Jonn Dillon; DocumentNumber: 11; Revision: 01; SheetNumber: 11; SheetTotal: 13; Version: 01; Project: Chassis Controller (Interim) 2020; PageSetup: Record=PageOptions|CenterHorizontal=True|CenterVertical=True|PrintScale=0.97|XCorrection=1.00|YCorrection=1.00|PrintKind=0|BorderSize=5000000|LeftOffset=0|BottomOffset=0|Orientation=2|PaperLength=1000|PaperWidth=1000|Scale=100|PaperSource=7|PrintQuality=-4|MediaType=1|DitherType=10|PaperKind=A4|PrintScaleMode=1
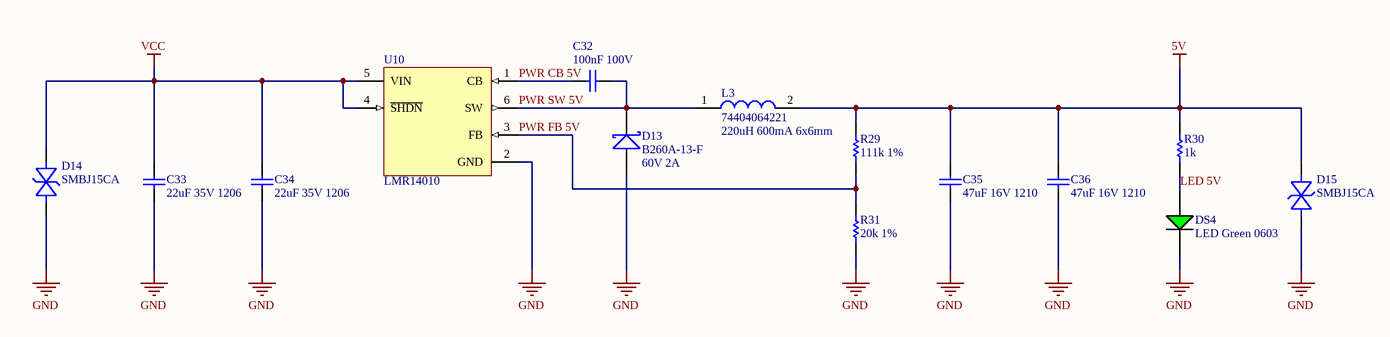
[diagram p10: CC-S10-V00-PSU-5V.SchDoc]

### Parts
C32  100nF 100V  [Cap_Ceramic_0603]
C33  22uF 35V 1206  [Cap_Ceramic_1206]
C34  22uF 35V 1206  [Cap_Ceramic_1206]
C35  47uF 16V 1210  [Cap_Ceramic_1210]
C36  47uF 16V 1210  [Cap_Ceramic_1210]
D13  B260A-13-F  [SMA]
D14  SMBJ15CA  [SMB]
D15  SMBJ15CA  [SMB]
DS4  LED Green 0603  [LED GREEN 0603]
L3  74404064221  [Inductor_6x6mm]
R29  111k 1%  [Res_ThinFilm_0603]
R30  1k  [Res_ThinFilm_0603]
R31  20k 1%  [Res_ThinFilm_0603]
U10  LMR14010  [LMR14010]

### Nets
5V: C35.2 C36.2 D15.K(Cathode) L3.2 R29.2 R30.2
GND: C33.1 C34.1 C35.1 C36.1 D13.A D14.A(Anode) D15.A(Anode) DS4.2(C) R31.1 U10.2(GND)
VCC: C33.2 C34.2 D14.K(Cathode) U10.4(~{SHDN}) U10.5(VIN)
LED 5V: DS4.1(A) R30.1
PWR CB 5V: C32.1 U10.1(CB)
PWR FB 5V: R29.1 R31.2 U10.3(FB)
PWR SW 5V: C32.2 D13.K L3.1 U10.6(SW)

### Notes on the sheet
- (near L3) 220uH 600mA 6x6mm
- (near D13) 60V 2A
- Revision History:
- Sheet Title:
- Rev
- Date
- Description
- Project:
- Size:
- Drawn By:
- A3
- Number:
- Revision:
- Sheet
- Version:
- of
- QUT Motorsport
- O-120, Gardens Point
- 2 George Street
- Brisbane, QLD 4000
- Australia
- Print Date:
- Print Time:
- File Name:

### Library data of the parts
C32 = 100nF 100V 5% X7R 0603: Capacitor, Ceramic, SMD, 100nF, 100V, 5%, X7R, 0603
C33 C34 = 22uF 35V 10% X7R 1206: Capacitor, Ceramic, SMD, 22uF, 35V, 10%, X7R, 1206
C35 C36 = 47uF 16V 10% X7R 1210: Capacitor, Ceramic, SMD, 47uF, 16V, 5%, X7R, 1210
D13 = B260A-13-F: Diode, Schottky Barrier Rectifier, 60 V, 2 A, B260A-13-F
D14 D15 = SMBJ15CA: Diode, SMD, TVS Diode, 15V 24.4V, DO214AA/SMB; ComponentLink1Description: Digikey; ComponentLink1URL: https://www.digikey.com.au/product-detail/en/littelfuse-inc/SMBJ15CA/SMBJ15CALFCT-ND/285983; ComponentLink2Description: Datasheet; ComponentLink2URL: https://www.littelfuse.com/~/media/electronics/datasheets/tvs_diodes/littelfuse_tvs_diode_smbj_datasheet.pdf.pdf
L3 = 74404064221: FIXED IND 220UH 660MA 850 MOHM; ComponentLink1Description: Digikey; ComponentLink1URL: https://www.digikey.com.au/product-detail/en/w%C3%BCrth-elektronik/74404064221/732-7261-1-ND/5353241; ComponentLink2Description: LCSC A; ComponentLink2URL: https://lcsc.com/product-detail/Power-Inductors_Sunlord-SWPA6045S221MT_C91047.html; ComponentLink3Description: LCSC B; ComponentLink3URL: https://lcsc.com/product-detail/Power-Inductors_SXN-Shun-Xiang-Nuo-Elec-SMNR6045-221MT_C467145.html
R29 = 111k 1% 0603: Resistor, SMD, 111k, 0.1W, 5%, 0603
R30 = 1k 5% 0603: Resistor, SMD, 1k, 0.1W, 5%, 0603
R31 = 20k 1% 0603: Resistor, SMD, 20k, 0.1W, 1%, 0603

## Sheet CC-S09-V00-PSU-3V3.SchDoc: Power Supply (9-25V to 3v3 @ 0.1-0.3A)
size A3; DrawnBy: Jonn Dillon; DocumentNumber: 10; Revision: 01; SheetNumber: 10; SheetTotal: 13; Version: 01; Project: Chassis Controller (Interim) 2020; PageSetup: Record=PageOptions|CenterHorizontal=True|CenterVertical=True|PrintScale=0.97|XCorrection=1.00|YCorrection=1.00|PrintKind=0|BorderSize=5000000|LeftOffset=0|BottomOffset=0|Orientation=2|PaperLength=1000|PaperWidth=1000|Scale=100|PaperSource=7|PrintQuality=-4|MediaType=1|DitherType=10|PaperKind=A4|PrintScaleMode=1
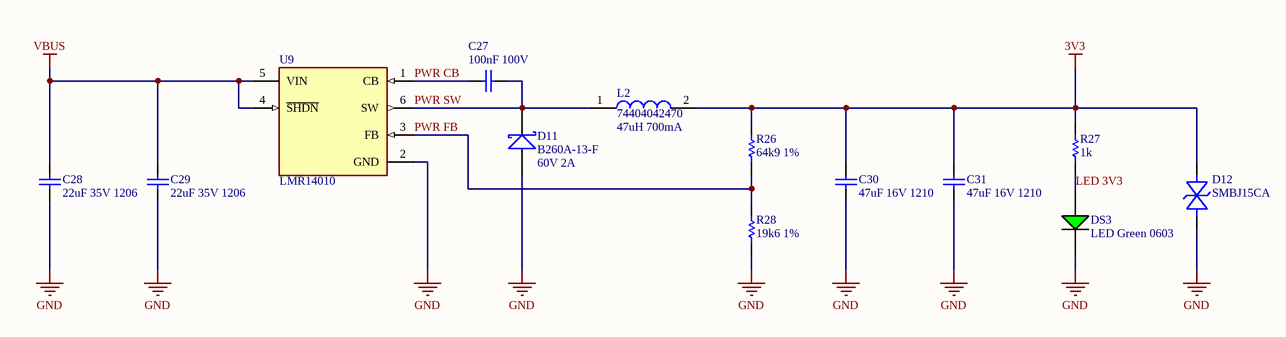
[diagram p11: CC-S09-V00-PSU-3V3.SchDoc]

### Parts
C27  100nF 100V  [Cap_Ceramic_0603]
C28  22uF 35V 1206  [Cap_Ceramic_1206]
C29  22uF 35V 1206  [Cap_Ceramic_1206]
C30  47uF 16V 1210  [Cap_Ceramic_1210]
C31  47uF 16V 1210  [Cap_Ceramic_1210]
D11  B260A-13-F  [SMA]
D12  SMBJ15CA  [SMB]
DS3  LED Green 0603  [LED GREEN 0603]
L2  74404042470  [INDUCTOR_4X3MM_1.8MM]
R26  64k9 1%  [Res_ThinFilm_0603]
R27  1k  [Res_ThinFilm_0603]
R28  19k6 1%  [Res_ThinFilm_0603]
U9  LMR14010  [LMR14010]

### Nets
3V3: C30.2 C31.2 D12.K(Cathode) L2.2 R26.2 R27.2
GND: C28.1 C29.1 C30.1 C31.1 D11.A D12.A(Anode) DS3.2(C) R28.1 U9.2(GND)
VBUS: C28.2 C29.2 U9.4(~{SHDN}) U9.5(VIN)
LED 3V3: DS3.1(A) R27.1
PWR CB: C27.1 U9.1(CB)
PWR FB: R26.1 R28.2 U9.3(FB)
PWR SW: C27.2 D11.K L2.1 U9.6(SW)

### Notes on the sheet
- (near L2) 47uH 700mA
- (near D11) 60V 2A
- Revision History:
- Sheet Title:
- Rev
- Date
- Description
- Project:
- Size:
- Drawn By:
- A3
- Number:
- Revision:
- Sheet
- Version:
- of
- QUT Motorsport
- O-120, Gardens Point
- 2 George Street
- Brisbane, QLD 4000
- Australia
- Print Date:
- Print Time:
- File Name:

### Library data of the parts
C27 = 100nF 100V 5% X7R 0603: as C32 on sheet CC-S10-V00-PSU-5V
C28 C29 = 22uF 35V 10% X7R 1206: as C33 on sheet CC-S10-V00-PSU-5V
C30 C31 = 47uF 16V 10% X7R 1210: as C35 on sheet CC-S10-V00-PSU-5V
D11 = B260A-13-F: as D13 on sheet CC-S10-V00-PSU-5V
D12 = SMBJ15CA: as D14 on sheet CC-S10-V00-PSU-5V; ComponentLink1Description: Digikey; ComponentLink1URL: https://www.digikey.com.au/product-detail/en/littelfuse-inc/SMBJ15CA/SMBJ15CALFCT-ND/285983; ComponentLink2Description: Datasheet; ComponentLink2URL: https://www.littelfuse.com/~/media/electronics/datasheets/tvs_diodes/littelfuse_tvs_diode_smbj_datasheet.pdf.pdf
L2 = 74404042470: 47µH Semi-Shielded Wirewound Inductor 600mA 620mOhm Nonstandard; ComponentLink1Description: Digikey; ComponentLink1URL: https://www.digikey.com/product-detail/en/w%C3%BCrth-elektronik/74404042470/732-5512-1-ND/4865405; ComponentLink2Description: LCSC A; ComponentLink2URL: https://lcsc.com/product-detail/Power-Inductors_Sunlord-SWPA6045S221MT_C91047.html; ComponentLink3Description: LCSC B; ComponentLink3URL: https://lcsc.com/product-detail/Power-Inductors_SXN-Shun-Xiang-Nuo-Elec-SMNR6045-221MT_C467145.html
R26 = 64k9 1% 0603: Resistor, SMD, 64k9, 0.1W, 5%, 0603
R27 = 1k 5% 0603: Resistor, SMD, 1k, 0.1W, 5%, 0603
R28 = 19k6 1% 0603: Resistor, SMD, 19k6, 0.1W, 5%, 0603

## Sheet CC-S12-V00-PowerSwitch.SchDoc: Power Switch (5V or USB to VBUS)
size A3; DrawnBy: Jonn Dillon; DocumentNumber: 13; SheetNumber: 13; SheetTotal: 13; Project: Chassis Controller (Interim) 2020
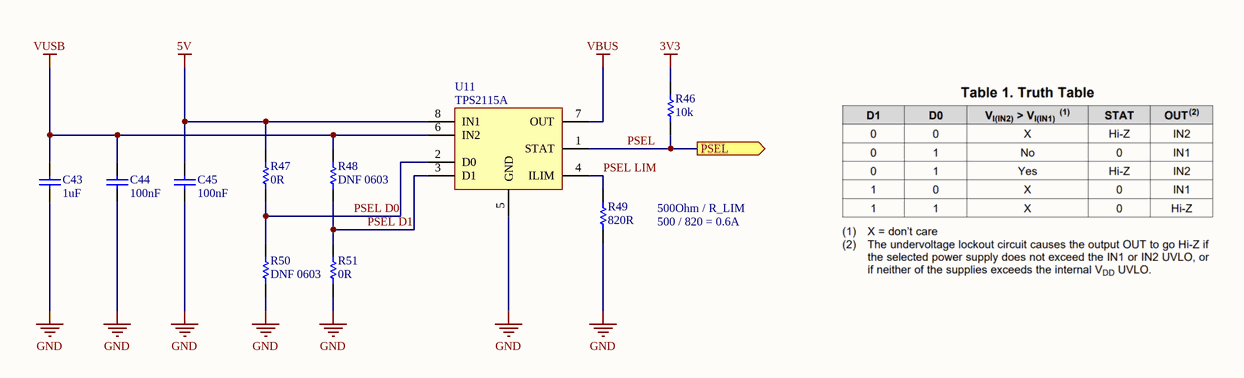
[diagram p12: CC-S12-V00-PowerSwitch.SchDoc]

### Parts
C43  1uF  [Cap_Ceramic_0603]
C44  100nF  [Cap_Ceramic_0603]
C45  100nF  [Cap_Ceramic_0603]
R46  10k  [Res_ThinFilm_0603]
R47  0R  [Res_ThinFilm_0603]
R48  DNF 0603  [Res_ThinFilm_0603]
R49  820R  [Res_ThinFilm_0603]
R50  DNF 0603  [Res_ThinFilm_0603]
R51  0R  [Res_ThinFilm_0603]
U11  TPS2115A  [TPS2115A]

### Ports
PSEL (out)

### Nets
3V3: R46.2
5V: C45.2 R47.2 U11.8(IN1)
GND: C43.1 C44.1 C45.1 R49.1 R50.1 R51.1 U11.5(GND)
VBUS: U11.7(OUT)
VUSB: C43.2 C44.2 R48.2 U11.6(IN2)
PSEL: R46.1 U11.1(STAT) ; port PSEL
PSEL D0: R47.1 R50.2 U11.2(D0)
PSEL D1: R48.1 R51.2 U11.3(D1)
PSEL LIM: R49.2 U11.4(ILIM)

### Notes on the sheet
- 500Ohm / R_LIM
- 500 / 820 = 0.6A
- Revision History:
- Sheet Title:
- Rev
- Date
- Description
- Project:
- Size:
- Drawn By:
- A3
- Number:
- Revision:
- Sheet
- Version:
- of
- QUT Motorsport
- O-120, Gardens Point
- 2 George Street
- Brisbane, QLD 4000
- Australia
- Print Date:
- Print Time:
- File Name:

### Library data of the parts
C43 = 1uF 25V 5% X7R 0603: as C7 on sheet CC-S01-V00-Microcontroller
C44 C45 = 100nF 50V 5% X7R 0603: as C25 on sheet CC-S03-V00-CANBUS
R46 = 10k 5% 0603: Resistor, SMD, 10k, 0.1W, 5%, 0603
R47 R51 = 0R 5% 0603: Resistor, SMD, 0R, 0.1W, 5%, 0603
R48 R50 = DNF 0603: Resistor, SMD, DNF, 0.1W, 0603
R49 = 820R 5% 0603: Resistor, SMD, 820R, 0.1W, 5%, 0603
U11 = TPS2115A: OR Controller Source Selector Switch N-Channel 2:1 8-TSSOP; ComponentLink1Description: Digikey; ComponentLink1URL: https://www.digikey.com.au/product-detail/en/texas-instruments/TPS2115AIPWRQ1/296-24155-1-ND/2000840